# Altium project Sayma_AMC.PrjPcb (part 13 of 18)

## Sheet FPGA_Banks_47_48_HP_FMC.SchDoc: Sayma AMC
size 420 x 297 mm; $$Internal___BlkDate: 0:12:25_2-9-18; $$Internal_NAME_PLACEHOLDER: a3sheet; $$Internal_Resolution: 00001mm; $$NotCommonProperty_@NAME: FPGA_XCKU040FFVA1156; $$NotCommonProperty_@PRINTORDER: 17; $$NotCommonProperty_@SHEET: FPGA Banks 47 48 HP FMC; $$NotCommonProperty_@SHEETTOTAL: 30; CmpIndex: 989; Drawing Author: G.Kasprowicz; Drawing Number: Sayma AMC; Drawing Project: AMC FMC Carrier Board; Drawing Revision: 2.0; SymIndex: 2141; CheckedBy: P.Kulik,T.Przywozki,W.Ruclo; Author: G.Kasprowicz; CompanyName: WUT ISE; DrawnBy: G.Kasprowicz; Organization: WUT ISE; Address1: PW ISE; Address2: Nowowiejska 15/19 00-665 Warsaw; Address3: gkasprow@gmail.com; DocumentNumber: 25; Revision: 2; SheetNumber: 25; SheetTotal: 32; ModifiedBy: -; CheckedDate: -; Title2: FPGA banks 47 & 48 - FMC; DivGrp: WUT ISE; Designer: G.Kasprowicz; ModifiedDate: -; ProjectName: Sensor Box
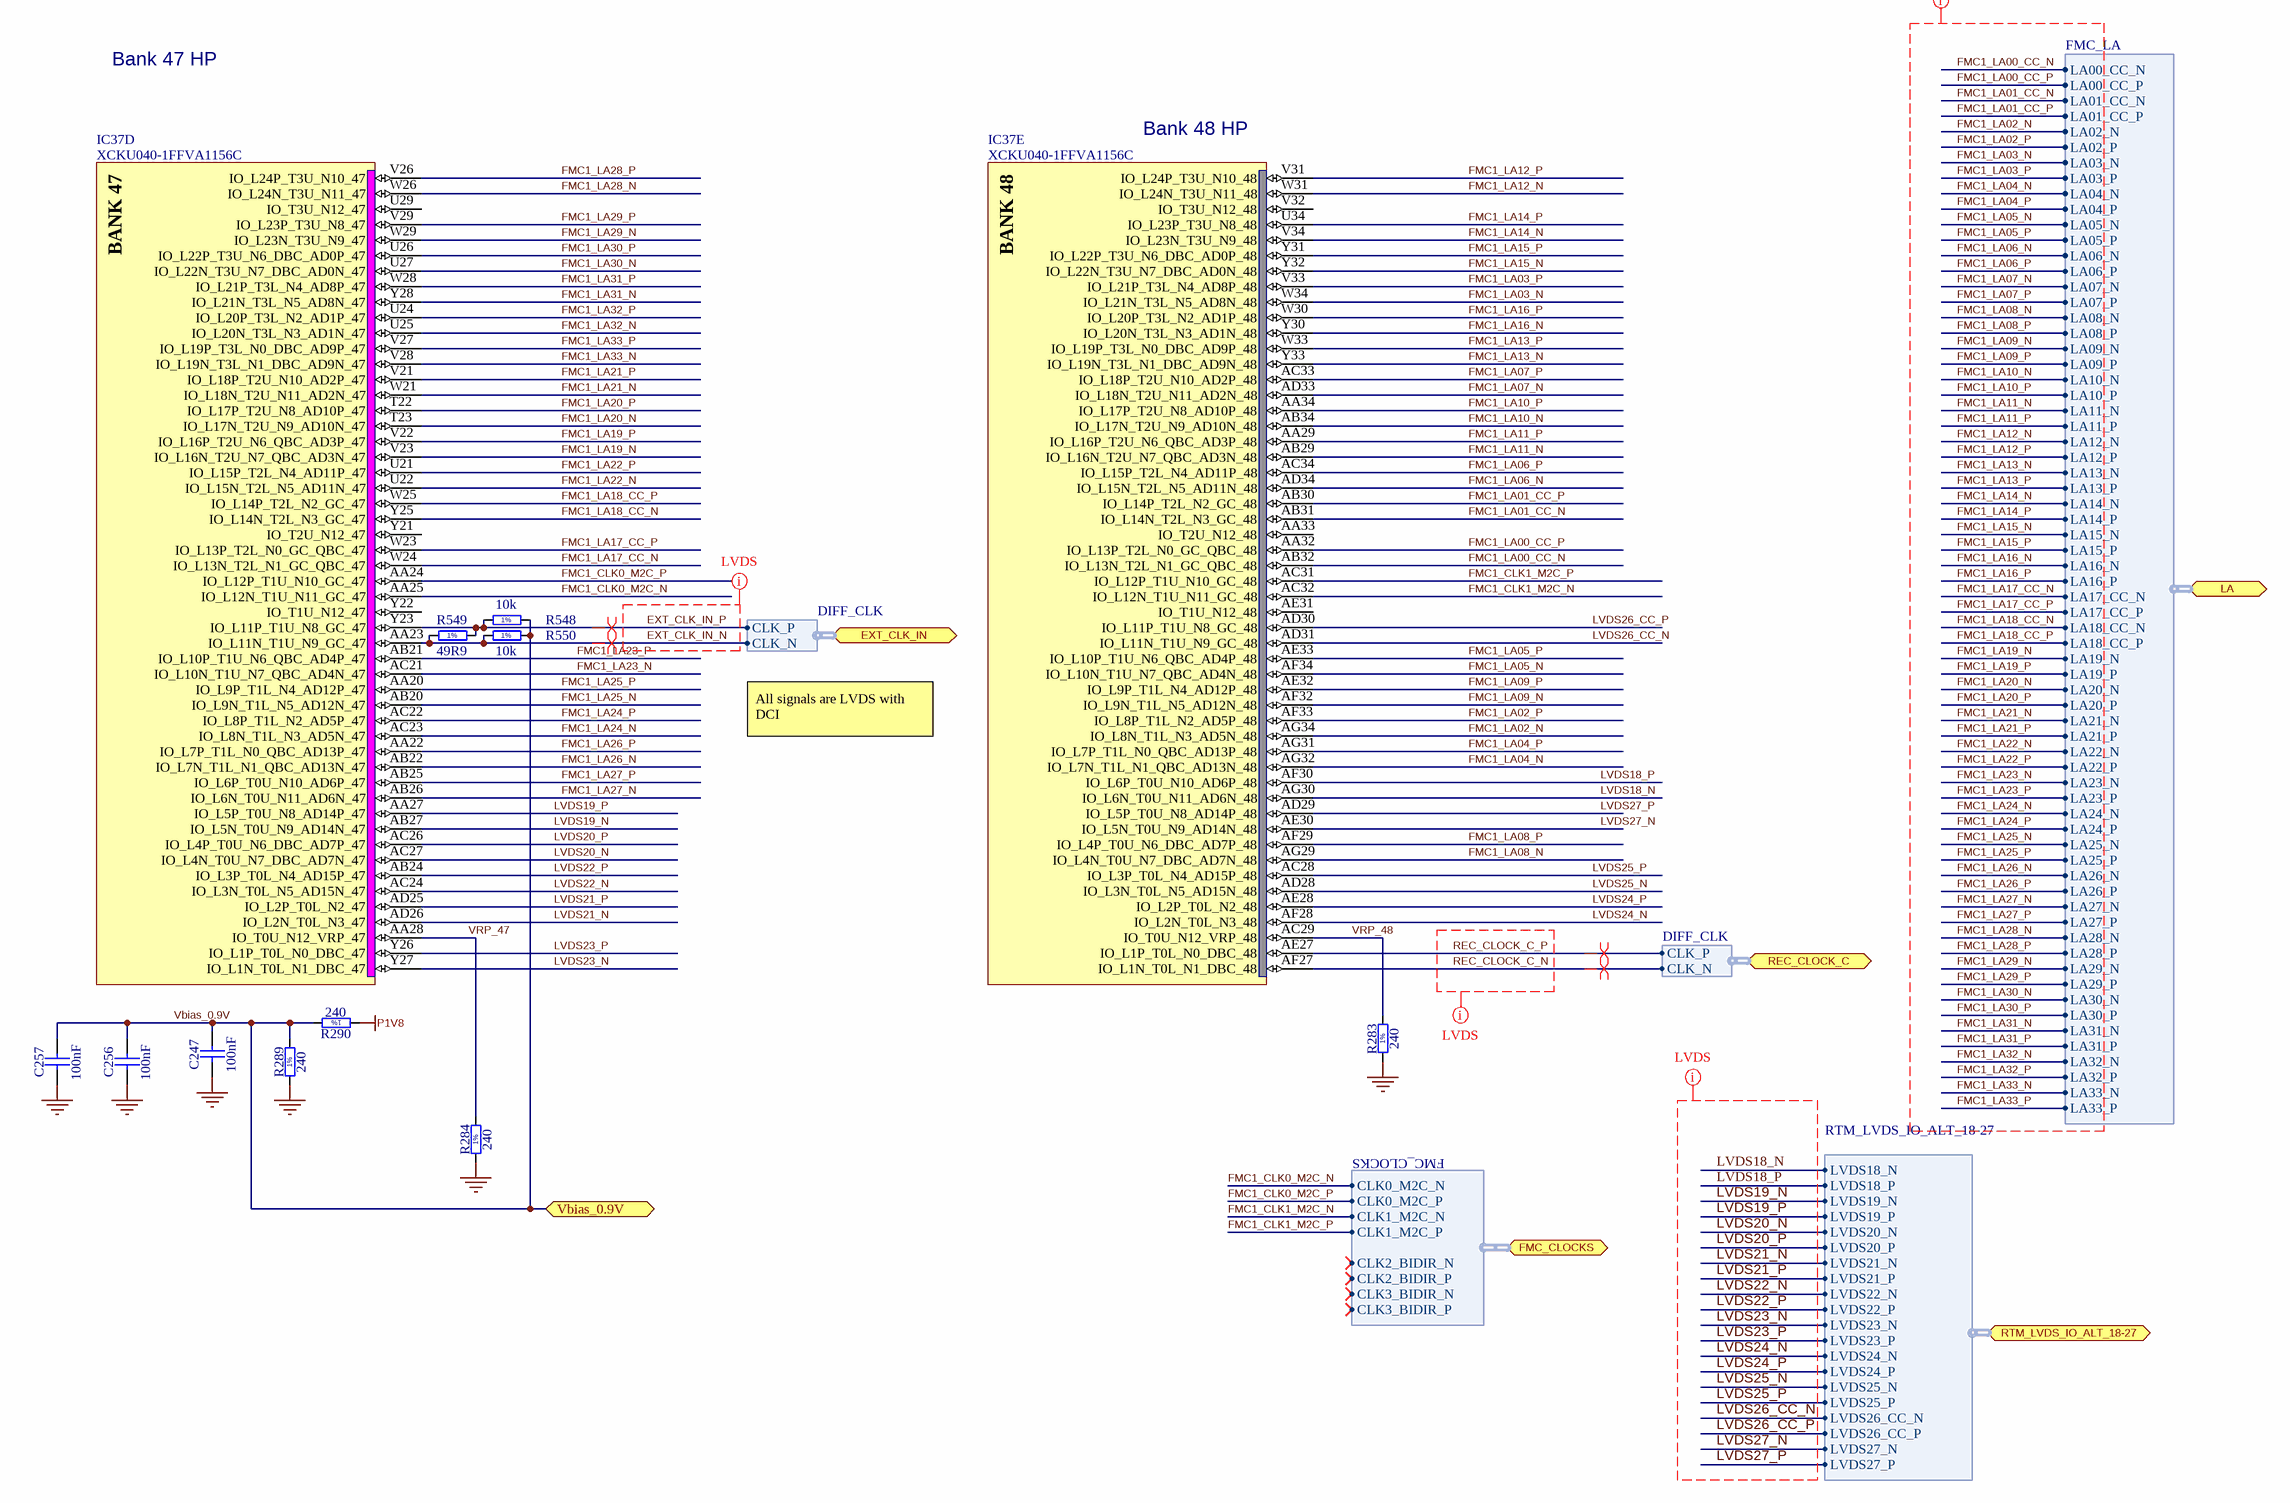
[diagram p22: FPGA_Banks_47_48_HP_FMC.SchDoc]

### Parts
C247  100nF  [CAPC0603X33N]
C256  100nF  [CAPC0603X33N]
C257  100nF  [CAPC0603X33N]
IC37  XCKU040-1FFVA1156C  [BGA1156C100P34X34_3500X3500X350]  (parts D,E of 22)
R283  240  [RESC1005X40N]
R284  240  [RESC1005X40N]
R289  240  [RESC1005X40N]
R290  240  [RESC1005X40N]
R548  10k  [RESC1005X40N]
R549  49R9  [RESC1005X40N]
R550  10k  [RESC1005X40N]

### Ports
EXT_CLK_IN (bidir, harness DIFF_CLK), FMC_CLOCKS (bidir, harness FMC_CLOCKS), LA (bidir, harness FMC_LA), REC_CLOCK_C (bidir, harness DIFF_CLK), RTM_LVDS_IO_ALT_18-27 (bidir, harness RTM_LVDS_IO_ALT_18-27), Vbias_0.9V (bidir)

### Harnesses
RTM_LVDS_IO_ALT_18-27: LVDS19_N, LVDS19_P, LVDS20_N, LVDS20_P, LVDS21_N, LVDS21_P, LVDS22_N, LVDS22_P, LVDS23_N, LVDS23_P, LVDS24_N, LVDS24_P, LVDS25_N, LVDS25_P, LVDS26_CC_N, LVDS26_CC_P, LVDS27_N, LVDS27_P, LVDS18_N, LVDS18_P
FMC_LA: LA00_CC_N, LA00_CC_P, LA01_CC_N, LA01_CC_P, LA02_N, LA02_P, LA03_N, LA03_P, LA04_N, LA04_P, LA05_N, LA05_P, LA06_N, LA06_P, LA07_N, LA07_P, LA08_N, LA08_P, LA09_N, LA09_P, LA10_N, LA10_P, LA11_N, LA11_P, LA12_N, LA12_P, LA13_N, LA13_P, LA14_N, LA14_P, LA15_N, LA15_P, LA16_N, LA16_P, LA17_CC_N, LA17_CC_P, LA18_CC_N, LA18_CC_P, LA19_N, LA19_P, LA20_N, LA20_P, LA21_N, LA21_P, LA22_N, LA22_P, LA23_N, LA23_P, LA24_N, LA25_N, LA25_P, LA24_P, LA26_N, LA26_P, LA27_N, LA27_P, LA28_N, LA28_P, LA29_N, LA29_P, LA30_N, LA30_P, LA31_N, LA31_P, LA32_N, LA32_P, LA33_N, LA33_P
FMC_CLOCKS: CLK0_M2C_N, CLK0_M2C_P, CLK1_M2C_N, CLK1_M2C_P, CLK2_BIDIR_N, CLK2_BIDIR_P, CLK3_BIDIR_N, CLK3_BIDIR_P
DIFF_CLK: CLK_N, CLK_P

### Nets
GND: C247.2 C256.2 C257.2 R283.1 R284.1 R289.1
P1V8: R290.1
EXT_CLK_IN_N: IC37.AA23(IO_L11N_T1U_N9_GC_47) R549.1 R550.1 ; port EXT_CLK_IN.CLK_N
EXT_CLK_IN_P: IC37.Y23(IO_L11P_T1U_N8_GC_47) R548.1 R549.2 ; port EXT_CLK_IN.CLK_P
FMC1_CLK0_M2C_N: IC37.AA25(IO_L12N_T1U_N11_GC_47) ; port FMC_CLOCKS.CLK0_M2C_N  [project net CLK0_M2C_N]
FMC1_CLK0_M2C_P: IC37.AA24(IO_L12P_T1U_N10_GC_47) ; port FMC_CLOCKS.CLK0_M2C_P  [project net CLK0_M2C_P]
FMC1_CLK1_M2C_N: IC37.AC32(IO_L12N_T1U_N11_GC_48) ; port FMC_CLOCKS.CLK1_M2C_N  [project net CLK1_M2C_N]
FMC1_CLK1_M2C_P: IC37.AC31(IO_L12P_T1U_N10_GC_48) ; port FMC_CLOCKS.CLK1_M2C_P  [project net CLK1_M2C_P]
FMC1_LA00_CC_N: IC37.AB32(IO_L13N_T2L_N1_GC_QBC_48) ; port LA.LA00_CC_N
FMC1_LA00_CC_P: IC37.AA32(IO_L13P_T2L_N0_GC_QBC_48) ; port LA.LA00_CC_P
FMC1_LA01_CC_N: IC37.AB31(IO_L14N_T2L_N3_GC_48) ; port LA.LA01_CC_N
FMC1_LA01_CC_P: IC37.AB30(IO_L14P_T2L_N2_GC_48) ; port LA.LA01_CC_P
FMC1_LA02_N: IC37.AG34(IO_L8N_T1L_N3_AD5N_48) ; port LA.LA02_N
FMC1_LA02_P: IC37.AF33(IO_L8P_T1L_N2_AD5P_48) ; port LA.LA02_P
FMC1_LA03_N: IC37.W34(IO_L21N_T3L_N5_AD8N_48) ; port LA.LA03_N
FMC1_LA03_P: IC37.V33(IO_L21P_T3L_N4_AD8P_48) ; port LA.LA03_P
FMC1_LA04_N: IC37.AG32(IO_L7N_T1L_N1_QBC_AD13N_48) ; port LA.LA04_N
FMC1_LA04_P: IC37.AG31(IO_L7P_T1L_N0_QBC_AD13P_48) ; port LA.LA04_P
FMC1_LA05_N: IC37.AF34(IO_L10N_T1U_N7_QBC_AD4N_48) ; port LA.LA05_N
FMC1_LA05_P: IC37.AE33(IO_L10P_T1U_N6_QBC_AD4P_48) ; port LA.LA05_P
FMC1_LA06_N: IC37.AD34(IO_L15N_T2L_N5_AD11N_48) ; port LA.LA06_N
FMC1_LA06_P: IC37.AC34(IO_L15P_T2L_N4_AD11P_48) ; port LA.LA06_P
FMC1_LA07_N: IC37.AD33(IO_L18N_T2U_N11_AD2N_48) ; port LA.LA07_N
FMC1_LA07_P: IC37.AC33(IO_L18P_T2U_N10_AD2P_48) ; port LA.LA07_P
FMC1_LA08_N: IC37.AG29(IO_L4N_T0U_N7_DBC_AD7N_48) ; port LA.LA08_N
FMC1_LA08_P: IC37.AF29(IO_L4P_T0U_N6_DBC_AD7P_48) ; port LA.LA08_P
FMC1_LA09_N: IC37.AF32(IO_L9N_T1L_N5_AD12N_48) ; port LA.LA09_N
FMC1_LA09_P: IC37.AE32(IO_L9P_T1L_N4_AD12P_48) ; port LA.LA09_P
FMC1_LA10_N: IC37.AB34(IO_L17N_T2U_N9_AD10N_48) ; port LA.LA10_N
FMC1_LA10_P: IC37.AA34(IO_L17P_T2U_N8_AD10P_48) ; port LA.LA10_P
FMC1_LA11_N: IC37.AB29(IO_L16N_T2U_N7_QBC_AD3N_48) ; port LA.LA11_N
FMC1_LA11_P: IC37.AA29(IO_L16P_T2U_N6_QBC_AD3P_48) ; port LA.LA11_P
FMC1_LA12_N: IC37.W31(IO_L24N_T3U_N11_48) ; port LA.LA12_N
FMC1_LA12_P: IC37.V31(IO_L24P_T3U_N10_48) ; port LA.LA12_P
FMC1_LA13_N: IC37.Y33(IO_L19N_T3L_N1_DBC_AD9N_48) ; port LA.LA13_N
FMC1_LA13_P: IC37.W33(IO_L19P_T3L_N0_DBC_AD9P_48) ; port LA.LA13_P
FMC1_LA14_N: IC37.V34(IO_L23N_T3U_N9_48) ; port LA.LA14_N
FMC1_LA14_P: IC37.U34(IO_L23P_T3U_N8_48) ; port LA.LA14_P
FMC1_LA15_N: IC37.Y32(IO_L22N_T3U_N7_DBC_AD0N_48) ; port LA.LA15_N
FMC1_LA15_P: IC37.Y31(IO_L22P_T3U_N6_DBC_AD0P_48) ; port LA.LA15_P
FMC1_LA16_N: IC37.Y30(IO_L20N_T3L_N3_AD1N_48) ; port LA.LA16_N
FMC1_LA16_P: IC37.W30(IO_L20P_T3L_N2_AD1P_48) ; port LA.LA16_P
FMC1_LA17_CC_N: IC37.W24(IO_L13N_T2L_N1_GC_QBC_47) ; port LA.LA17_CC_N
FMC1_LA17_CC_P: IC37.W23(IO_L13P_T2L_N0_GC_QBC_47) ; port LA.LA17_CC_P
FMC1_LA18_CC_N: IC37.Y25(IO_L14N_T2L_N3_GC_47) ; port LA.LA18_CC_N
FMC1_LA18_CC_P: IC37.W25(IO_L14P_T2L_N2_GC_47) ; port LA.LA18_CC_P
FMC1_LA19_N: IC37.V23(IO_L16N_T2U_N7_QBC_AD3N_47) ; port LA.LA19_N
FMC1_LA19_P: IC37.V22(IO_L16P_T2U_N6_QBC_AD3P_47) ; port LA.LA19_P
FMC1_LA20_N: IC37.T23(IO_L17N_T2U_N9_AD10N_47) ; port LA.LA20_N
FMC1_LA20_P: IC37.T22(IO_L17P_T2U_N8_AD10P_47) ; port LA.LA20_P
FMC1_LA21_N: IC37.W21(IO_L18N_T2U_N11_AD2N_47) ; port LA.LA21_N
FMC1_LA21_P: IC37.V21(IO_L18P_T2U_N10_AD2P_47) ; port LA.LA21_P
FMC1_LA22_N: IC37.U22(IO_L15N_T2L_N5_AD11N_47) ; port LA.LA22_N
FMC1_LA22_P: IC37.U21(IO_L15P_T2L_N4_AD11P_47) ; port LA.LA22_P
FMC1_LA23_N: IC37.AC21(IO_L10N_T1U_N7_QBC_AD4N_47) ; port LA.LA23_N
FMC1_LA23_P: IC37.AB21(IO_L10P_T1U_N6_QBC_AD4P_47) ; port LA.LA23_P
FMC1_LA24_N: IC37.AC23(IO_L8N_T1L_N3_AD5N_47) ; port LA.LA24_N
FMC1_LA24_P: IC37.AC22(IO_L8P_T1L_N2_AD5P_47) ; port LA.LA24_P
FMC1_LA25_N: IC37.AB20(IO_L9N_T1L_N5_AD12N_47) ; port LA.LA25_N
FMC1_LA25_P: IC37.AA20(IO_L9P_T1L_N4_AD12P_47) ; port LA.LA25_P
FMC1_LA26_N: IC37.AB22(IO_L7N_T1L_N1_QBC_AD13N_47) ; port LA.LA26_N
FMC1_LA26_P: IC37.AA22(IO_L7P_T1L_N0_QBC_AD13P_47) ; port LA.LA26_P
FMC1_LA27_N: IC37.AB26(IO_L6N_T0U_N11_AD6N_47) ; port LA.LA27_N
FMC1_LA27_P: IC37.AB25(IO_L6P_T0U_N10_AD6P_47) ; port LA.LA27_P
FMC1_LA28_N: IC37.W26(IO_L24N_T3U_N11_47) ; port LA.LA28_N
FMC1_LA28_P: IC37.V26(IO_L24P_T3U_N10_47) ; port LA.LA28_P
FMC1_LA29_N: IC37.W29(IO_L23N_T3U_N9_47) ; port LA.LA29_N
FMC1_LA29_P: IC37.V29(IO_L23P_T3U_N8_47) ; port LA.LA29_P
FMC1_LA30_N: IC37.U27(IO_L22N_T3U_N7_DBC_AD0N_47) ; port LA.LA30_N
FMC1_LA30_P: IC37.U26(IO_L22P_T3U_N6_DBC_AD0P_47) ; port LA.LA30_P
FMC1_LA31_N: IC37.Y28(IO_L21N_T3L_N5_AD8N_47) ; port LA.LA31_N
FMC1_LA31_P: IC37.W28(IO_L21P_T3L_N4_AD8P_47) ; port LA.LA31_P
FMC1_LA32_N: IC37.U25(IO_L20N_T3L_N3_AD1N_47) ; port LA.LA32_N
FMC1_LA32_P: IC37.U24(IO_L20P_T3L_N2_AD1P_47) ; port LA.LA32_P
FMC1_LA33_N: IC37.V28(IO_L19N_T3L_N1_DBC_AD9N_47) ; port LA.LA33_N
FMC1_LA33_P: IC37.V27(IO_L19P_T3L_N0_DBC_AD9P_47) ; port LA.LA33_P
LVDS18_N: IC37.AG30(IO_L6N_T0U_N11_AD6N_48) ; port RTM_LVDS_IO_ALT_18-27.LVDS18_N
LVDS18_P: IC37.AF30(IO_L6P_T0U_N10_AD6P_48) ; port RTM_LVDS_IO_ALT_18-27.LVDS18_P
LVDS19_N: IC37.AB27(IO_L5N_T0U_N9_AD14N_47) ; port RTM_LVDS_IO_ALT_18-27.LVDS19_N
LVDS19_P: IC37.AA27(IO_L5P_T0U_N8_AD14P_47) ; port RTM_LVDS_IO_ALT_18-27.LVDS19_P
LVDS20_N: IC37.AC27(IO_L4N_T0U_N7_DBC_AD7N_47) ; port RTM_LVDS_IO_ALT_18-27.LVDS20_N
LVDS20_P: IC37.AC26(IO_L4P_T0U_N6_DBC_AD7P_47) ; port RTM_LVDS_IO_ALT_18-27.LVDS20_P
LVDS21_N: IC37.AD26(IO_L2N_T0L_N3_47) ; port RTM_LVDS_IO_ALT_18-27.LVDS21_N
LVDS21_P: IC37.AD25(IO_L2P_T0L_N2_47) ; port RTM_LVDS_IO_ALT_18-27.LVDS21_P
LVDS22_N: IC37.AC24(IO_L3N_T0L_N5_AD15N_47) ; port RTM_LVDS_IO_ALT_18-27.LVDS22_N
LVDS22_P: IC37.AB24(IO_L3P_T0L_N4_AD15P_47) ; port RTM_LVDS_IO_ALT_18-27.LVDS22_P
LVDS23_N: IC37.Y27(IO_L1N_T0L_N1_DBC_47) ; port RTM_LVDS_IO_ALT_18-27.LVDS23_N
LVDS23_P: IC37.Y26(IO_L1P_T0L_N0_DBC_47) ; port RTM_LVDS_IO_ALT_18-27.LVDS23_P
LVDS24_N: IC37.AF28(IO_L2N_T0L_N3_48) ; port RTM_LVDS_IO_ALT_18-27.LVDS24_N
LVDS24_P: IC37.AE28(IO_L2P_T0L_N2_48) ; port RTM_LVDS_IO_ALT_18-27.LVDS24_P
LVDS25_N: IC37.AD28(IO_L3N_T0L_N5_AD15N_48) ; port RTM_LVDS_IO_ALT_18-27.LVDS25_N
LVDS25_P: IC37.AC28(IO_L3P_T0L_N4_AD15P_48) ; port RTM_LVDS_IO_ALT_18-27.LVDS25_P
LVDS26_CC_N: IC37.AD31(IO_L11N_T1U_N9_GC_48) ; port RTM_LVDS_IO_ALT_18-27.LVDS26_CC_N
LVDS26_CC_P: IC37.AD30(IO_L11P_T1U_N8_GC_48) ; port RTM_LVDS_IO_ALT_18-27.LVDS26_CC_P
LVDS27_N: IC37.AE30(IO_L5N_T0U_N9_AD14N_48) ; port RTM_LVDS_IO_ALT_18-27.LVDS27_N
LVDS27_P: IC37.AD29(IO_L5P_T0U_N8_AD14P_48) ; port RTM_LVDS_IO_ALT_18-27.LVDS27_P
REC_CLOCK_C_N: IC37.AF27(IO_L1N_T0L_N1_DBC_48) ; port REC_CLOCK_C.CLK_N
REC_CLOCK_C_P: IC37.AE27(IO_L1P_T0L_N0_DBC_48) ; port REC_CLOCK_C.CLK_P
Vbias_0.9V: C247.1 C256.1 C257.1 R289.2 R290.2 R548.2 R550.2 ; port Vbias_0.9V
VRP_47: IC37.AA28(IO_T0U_N12_VRP_47) R284.2
VRP_48: IC37.AC29(IO_T0U_N12_VRP_48) R283.2

Not connected (* = marked no-connect by the designer): IC37 AA33(IO_T2U_N12_48) AE31(IO_T1U_N12_48) U29(IO_T3U_N12_47) V32(IO_T3U_N12_48) Y21(IO_T2U_N12_47) Y22(IO_T1U_N12_47)

### Layout directives
differential pair: EXT_CLK_IN_N, EXT_CLK_IN_P, REC_CLOCK_C_N, REC_CLOCK_C_P
net class LVDS: EXT_CLK_IN_N, EXT_CLK_IN_P, LVDS18_N, LVDS18_P, LVDS19_N, LVDS19_P, LVDS20_N, LVDS20_P, LVDS21_N, LVDS21_P, LVDS22_N, LVDS22_P, LVDS23_N, LVDS23_P, LVDS24_N, LVDS24_P, LVDS25_N, LVDS25_P, LVDS26_CC_N, LVDS26_CC_P, LVDS27_N, LVDS27_P, REC_CLOCK_C_N, REC_CLOCK_C_P
net class LVDS_FMC: FMC1_LA00_CC_N, FMC1_LA00_CC_P, FMC1_LA01_CC_N, FMC1_LA01_CC_P, FMC1_LA02_N, FMC1_LA02_P, FMC1_LA03_N, FMC1_LA03_P, FMC1_LA04_N, FMC1_LA04_P, FMC1_LA05_N, FMC1_LA05_P, FMC1_LA06_N, FMC1_LA06_P, FMC1_LA07_N, FMC1_LA07_P, FMC1_LA08_N, FMC1_LA08_P, FMC1_LA09_N, FMC1_LA09_P, FMC1_LA10_N, FMC1_LA10_P, FMC1_LA11_N, FMC1_LA11_P, FMC1_LA12_N, FMC1_LA12_P, FMC1_LA13_N, FMC1_LA13_P, FMC1_LA14_N, FMC1_LA14_P, FMC1_LA15_N, FMC1_LA15_P, FMC1_LA16_N, FMC1_LA16_P, FMC1_LA17_CC_N, FMC1_LA17_CC_P, FMC1_LA18_CC_N, FMC1_LA18_CC_P, FMC1_LA19_N, FMC1_LA19_P, FMC1_LA20_N, FMC1_LA20_P, FMC1_LA21_N, FMC1_LA21_P, FMC1_LA22_N, FMC1_LA22_P, FMC1_LA23_N, FMC1_LA23_P, FMC1_LA24_N, FMC1_LA24_P, FMC1_LA25_N, FMC1_LA25_P, FMC1_LA26_N, FMC1_LA26_P, FMC1_LA27_N, FMC1_LA27_P, FMC1_LA28_N, FMC1_LA28_P, FMC1_LA29_N, FMC1_LA29_P, FMC1_LA30_N, FMC1_LA30_P, FMC1_LA31_N, FMC1_LA31_P, FMC1_LA32_N, FMC1_LA32_P, FMC1_LA33_N, FMC1_LA33_P

### Notes on the sheet
- Bank 47 HP
- (near IC37) Bank 48 HP
- All signals are LVDS with DCI
- Project/Equipment
- Document
- Designer
- Drawn by
- Check.by
- Copyright WUT ISE 2018.
  This documentation describes Open Hardware and is licensed under the CERN OHL v.1.1. You may redistribute and modify this documentation under the terms of the CERN OHL v.1.1. (http://ohwr.org/CERNOHL). This documentation is distributed WITHOUT ANY EXPRESS OR IMPLIED WARRANTY, INCLUDING OF MERCHANTABILITY, SATISFACTORY QUALITY AND FITNESS FOR A PARTICULAR PURPOSE. Please see the CERN OHL v.1.1 for applicable conditions.
- Contact
- File
- Last Mod.
- Print Date
- Sheet
- Size
- A3
- of
- Rev
- (in symbol R0402_10K_1%_0.0625W_100PPM) 1%
- (in symbol R0402_49R9_1%_0.0625W_100PPM) 1%
- (in symbol R0402_240R_1%_0.0625W_100PPM) 1%
- (in symbol XCKU040-1FFVA1156C, part D) BANK 47
- (in symbol XCKU040-1FFVA1156C, part E) BANK 48

### Library data of the parts
C247 C256 C257 = CC0201_100NF_6.3V_10%_X5R: Non-polarised capacitor; Manufacturer: GENERIC; Part Description: SMD Multilayer Chip Ceramic Capacitor; Manufacturer1 Part Number: 02016D104KAT2A; Tolerance: ±10%; Voltage: 6.3V; TC: X5R; Manufacturer Part Number: CC0201_100NF_6.3V_10%_X5R; Part Number: CC0201_100NF_6.3V_10%_X5R; Value: 100nF; Component Kind: Standard; Component Type: Standard; Pin Count: 2; Status: Not Recommended; Case: 0201; Mounted: Yes; Socket: No; SMD: Yes; Sense: No; Manufacturer1 Example: AVX; Manufacturer1 ComponentHeight: 0.33mm; HelpURL: \\cern.ch\dfs\Applications\Altium\Datasheets\CC0201_X5R_AVX.pdf; Author: CERN DEM JLC; CreateDate: 03.12.2007; LatestRevisionDate: 03.12.2007
IC37 = XCKU040-1FFVA1156C: Kintex UltraScale FPGA, 520 I/O, 530K Cells, 1156-Ball BGA, Speed Grade 1, Commercial Grade; Manufacturer: XILINX; Part Description: Kintex UltraScale, 40 DLL I/O, 416 HP I/O, 104 HR I/O, 1156-Pin BGA, Speed Grade 1, Commercial Grade; PressFit: No; Bonding: No; Manufacturer Part Number: XCKU040-1FFVA1156C; PackageDescription: BGA, 1.00mm Pitch, Square; 1156 Pin, 34 Columns X 34 Rows, Body 35.00mm X 35.00mm X 3.50mm H, IPC Medium Density; Part Number: XCKU040-1FFVA1156C; Component Kind: Standard; Component Type: Standard; Device: XCKU040-1FFVA1156C; Pin Count: 1156; Case: BGA1156; Mounted: Yes; Socket: No; SMD: Yes; Sense: No; ComponentHeight: 3.5mm; HelpURL: \\cern.ch\dfs\Applications\Altium\Datasheets\XCKU040-1FFVA1156C.pdf; ComponentLink1URL: \\cern.ch\dfs\Applications\Altium\Datasheets\XCKU040-1FFVA1156C_Package-Pinout.pdf; ComponentLink1Description: Package/Pinout; Author: CERN DEM CA; CreateDate: 16.08.2016; LatestRevisionDate: 16.08.2016
R283 R284 R289 R290 = R0402_240R_1%_0.0625W_100PPM: Resistor - 1%; Manufacturer: GENERIC; Part Description: General Purpose Thick Film Chip Resistor; Manufacturer1 Part Number: 232270672401L; TC: ±100ppm/°C; PressFit: No; Manufacturer Part Number: R0402_240R_1%_0.0625W_100PPM; Part Number: R0402_240R_1%_0.0625W_100PPM; Tolerance: ±1%; Value: 240; Component Kind: Standard; Component Type: Standard; Pin Count: 2; Status: Not Recommended; Power: 0.0625W; Case: 0402; Mounted: Yes; Sense: No; Socket: No; SMD: Yes; Manufacturer1 Example: YAGEO PHYCOMP; Manufacturer1 ComponentHeight: 0.4mm; HelpURL: \\cern.ch\dfs\Applications\Altium\Datasheets\R0402_Phycomp_RC0402.pdf; Author: CERN DEM JLC; CreateDate: 03.12.2007; LatestRevisionDate: 17.10.2012
R548 R550 = R0402_10K_1%_0.0625W_100PPM: Resistor - 1%; Manufacturer: GENERIC; Part Description: General Purpose Thick Film Chip Resistor; Manufacturer1 Part Number: 232270671003L; TC: ±100ppm/°C; PressFit: No; Manufacturer Part Number: R0402_10K_1%_0.0625W_100PPM; Part Number: R0402_10K_1%_0.0625W_100PPM; Tolerance: ±1%; Value: 10k; Component Kind: Standard; Component Type: Standard; Pin Count: 2; Status: Not Recommended; Power: 0.0625W; Case: 0402; Mounted: Yes; Sense: No; Socket: No; SMD: Yes; Manufacturer1 Example: YAGEO PHYCOMP; Manufacturer1 ComponentHeight: 0.4mm; HelpURL: \\cern.ch\dfs\Applications\Altium\Datasheets\R0402_Phycomp_RC0402.pdf; Author: CERN DEM JLC; CreateDate: 03.12.2007; LatestRevisionDate: 17.10.2012
R549 = R0402_49R9_1%_0.0625W_100PPM: Resistor - 1%; Manufacturer: GENERIC; Part Description: General Purpose Thick Film Chip Resistor; Manufacturer1 Part Number: 232270674999L or RC0402FR-0749R9L; TC: ±100ppm/°C; PressFit: No; Manufacturer Part Number: R0402_49R9_1%_0.0625W_100PPM; Part Number: R0402_49R9_1%_0.0625W_100PPM; Tolerance: ±1%; Value: 49R9; Component Kind: Standard; Component Type: Standard; Pin Count: 2; Status: Not Recommended; Power: 0.0625W; Case: 0402; Mounted: Yes; Sense: No; Socket: No; SMD: Yes; Manufacturer1 Example: YAGEO PHYCOMP; Manufacturer1 ComponentHeight: 0.4mm; HelpURL: \\cern.ch\dfs\Applications\Altium\Datasheets\R0402_Phycomp_RC0402.pdf; Author: CERN DEM JLC; CreateDate: 24.10.2012; LatestRevisionDate: 24.10.2012

## Sheet FPGA_Banks_64_65_HR.SchDoc: Sayma AMC
size 420 x 297 mm; $$Internal___BlkDate: 0:12:25_2-9-18; $$Internal_NAME_PLACEHOLDER: a3sheet; $$Internal_Resolution: 00001mm; $$NotCommonProperty_@NAME: FPGA_XCKU040FFVA1156; $$NotCommonProperty_@PRINTORDER: 18; $$NotCommonProperty_@SHEET: FPGA Banks 64 65 HR; $$NotCommonProperty_@SHEETTOTAL: 30; CmpIndex: 990; Drawing Author: G.Kasprowicz; Drawing Number: Sayma AMC; Drawing Project: AMC FMC Carrier Board; Drawing Revision: 2.0; SymIndex: 2141; CheckedBy: P.Kulik,T.Przywozki,W.Ruclo; Author: G.Kasprowicz; CompanyName: WUT ISE; DrawnBy: G.Kasprowicz; Organization: WUT ISE; Address1: PW ISE; Address2: Nowowiejska 15/19 00-665 Warsaw; Address3: gkasprow@gmail.com; DocumentNumber: 26; Revision: 2; SheetNumber: 26; SheetTotal: 32; ModifiedBy: -; CheckedDate: -; Title2: FPGA banks 64 & 65; DivGrp: WUT ISE; Designer: G.Kasprowicz; ModifiedDate: -; ProjectName: Sensor Box
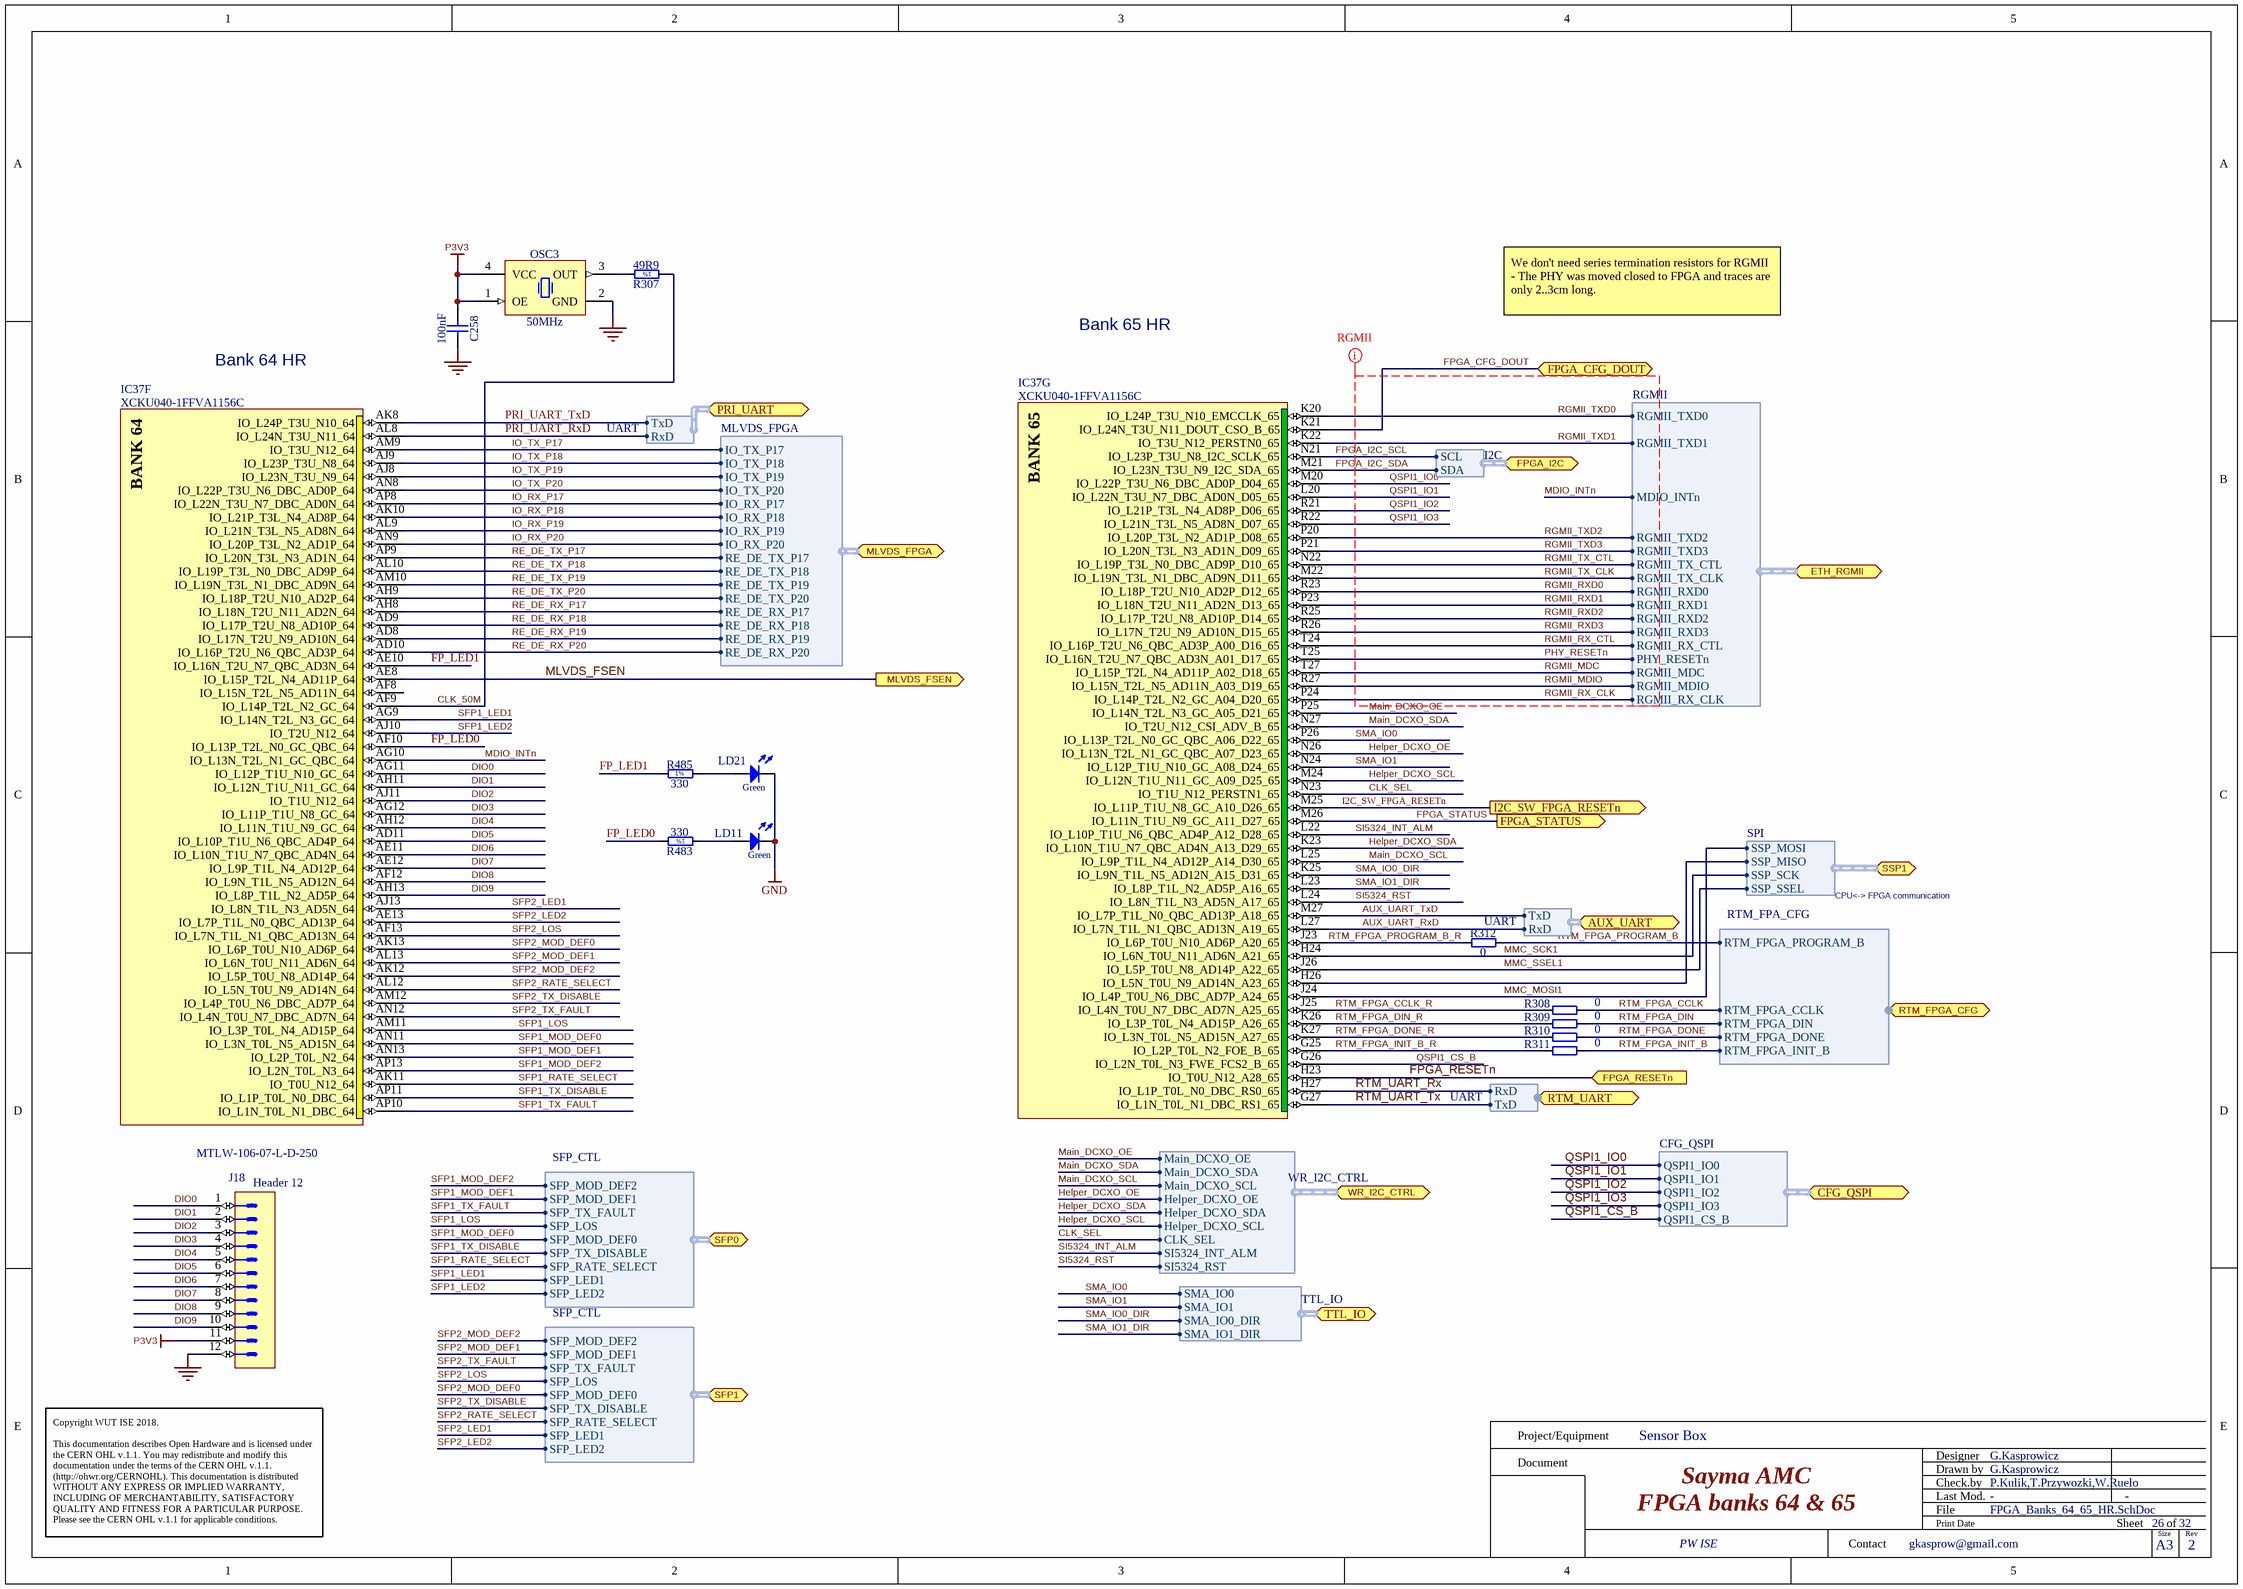
[diagram p23: FPGA_Banks_64_65_HR.SchDoc]

### Parts
C258  100nF  [CAPC0603X33N]
IC37  XCKU040-1FFVA1156C  [BGA1156C100P34X34_3500X3500X350]  (parts F,G of 22)
J18  Header 12  Manufacturer Part Number: MTLW-106-07-L-D-250  [SAMTEC_MTLW-106-07-L-D-250]
LD11  Green  [LED_AVAGO_HSME-C120]
LD21  Green  [LED_KINGBRIGHT_KPH-1608CGCK]
OSC3  50MHz  [OSCSC254P320X500X130-4N]
R307  49R9  [RESC1005X40N]
R308  0  [RESC1005X40N]
R309  0  [RESC1005X40N]
R310  0  [RESC1005X40N]
R311  0  [RESC1005X40N]
R312  0  [RESC1005X40N]
R483  330  [RESC1005X40N]
R485  330  [RESC1005X40N]

### Ports
AUX_UART (bidir, harness UART), CFG_QSPI (bidir, harness CFG_QSPI), ETH_RGMII (bidir, harness RGMII), FPGA_CFG_DOUT (bidir), FPGA_I2C (bidir, harness I2C), FPGA_RESETn (in), FPGA_STATUS (out), I2C_SW_FPGA_RESETn (out), MLVDS_FPGA (bidir, harness MLVDS_FPGA), MLVDS_FSEN (out), PRI_UART (bidir, harness UART), RTM_FPGA_CFG (bidir, harness RTM_FPA_CFG), RTM_UART (bidir, harness UART), SFP0 (bidir, harness SFP_CTL), SFP1 (bidir, harness SFP_CTL), SSP1 (bidir, harness SPI), TTL_IO (bidir, harness TTL_IO), WR_I2C_CTRL (bidir, harness WR_I2C_CTRL)

### Harnesses
SFP_CTL: SFP_MOD_DEF2, SFP_MOD_DEF1, SFP_TX_FAULT, SFP_LOS, SFP_MOD_DEF0, SFP_TX_DISABLE, SFP_RATE_SELECT, SFP_LED1, SFP_LED2
MLVDS_FPGA: IO_TX_P17, IO_RX_P17, IO_RX_P18, IO_RX_P19, IO_RX_P20, IO_TX_P18, IO_TX_P19, IO_TX_P20, RE_DE_TX_P17, RE_DE_TX_P18, RE_DE_TX_P19, RE_DE_TX_P20, RE_DE_RX_P17, RE_DE_RX_P18, RE_DE_RX_P19, RE_DE_RX_P20
I2C: SCL, SDA
SPI: SSP_SCK, SSP_SSEL, SSP_MISO, SSP_MOSI
CFG_QSPI: QSPI1_IO0, QSPI1_IO1, QSPI1_IO2, QSPI1_IO3, QSPI1_CS_B
RTM_FPA_CFG: RTM_FPGA_DIN, RTM_FPGA_CCLK, RTM_FPGA_PROGRAM_B, RTM_FPGA_DONE, RTM_FPGA_INIT_B
UART: RxD, TxD
RGMII: RGMII_RX_CTL, RGMII_RX_CLK, RGMII_RXD3, RGMII_TX_CTL, RGMII_TX_CLK, RGMII_TXD0, RGMII_TXD1, RGMII_TXD2, RGMII_TXD3, RGMII_MDC, RGMII_MDIO, PHY_RESETn, MDIO_INTn, RGMII_RXD0, RGMII_RXD1, RGMII_RXD2
WR_I2C_CTRL: Main_DCXO_OE, Main_DCXO_SDA, Main_DCXO_SCL, Helper_DCXO_OE, Helper_DCXO_SDA, Helper_DCXO_SCL, CLK_SEL, SI5324_INT_ALM, SI5324_RST
TTL_IO: SMA_IO0, SMA_IO1, SMA_IO0_DIR, SMA_IO1_DIR

### Nets
GND: C258.1 J18.12 LD11.1(C) LD21.1(C) OSC3.2(GND)
P3V3: C258.2 J18.11 OSC3.1(OE) OSC3.4(VCC)
AUX_UART_RxD: IC37.L27(IO_L7N_T1L_N1_QBC_AD13N_A19_65) ; port AUX_UART.RxD
AUX_UART_TxD: IC37.M27(IO_L7P_T1L_N0_QBC_AD13P_A18_65) ; port AUX_UART.TxD
CLK_50M: IC37.AF9(IO_L14P_T2L_N2_GC_64) R307.1
CLK_SEL: IC37.N23(IO_T1U_N12_PERSTN1_65) ; port WR_I2C_CTRL.CLK_SEL
DIO0: IC37.AG11(IO_L12P_T1U_N10_GC_64) J18.1
DIO1: IC37.AH11(IO_L12N_T1U_N11_GC_64) J18.2
DIO2: IC37.AJ11(IO_T1U_N12_64) J18.3
DIO3: IC37.AG12(IO_L11P_T1U_N8_GC_64) J18.4
DIO4: IC37.AH12(IO_L11N_T1U_N9_GC_64) J18.5
DIO5: IC37.AD11(IO_L10P_T1U_N6_QBC_AD4P_64) J18.6
DIO6: IC37.AE11(IO_L10N_T1U_N7_QBC_AD4N_64) J18.7
DIO7: IC37.AE12(IO_L9P_T1L_N4_AD12P_64) J18.8
DIO8: IC37.AF12(IO_L9N_T1L_N5_AD12N_64) J18.9
DIO9: IC37.AH13(IO_L8P_T1L_N2_AD5P_64) J18.10
FP_LED0: IC37.AF10(IO_L13P_T2L_N0_GC_QBC_64) R483.2
FP_LED1: IC37.AE10(IO_L16N_T2U_N7_QBC_AD3N_64) R485.1
FPGA_CFG_DOUT: IC37.K21(IO_L24N_T3U_N11_DOUT_CSO_B_65) ; port FPGA_CFG_DOUT
FPGA_I2C_SCL: IC37.N21(IO_L23P_T3U_N8_I2C_SCLK_65) ; port FPGA_I2C.SCL
FPGA_I2C_SDA: IC37.M21(IO_L23N_T3U_N9_I2C_SDA_65) ; port FPGA_I2C.SDA
FPGA_RESETn: IC37.H23(IO_T0U_N12_A28_65) ; port FPGA_RESETn
FPGA_STATUS: IC37.M26(IO_L11N_T1U_N9_GC_A11_D27_65) ; port FPGA_STATUS
Helper_DCXO_OE: IC37.N26(IO_L13N_T2L_N1_GC_QBC_A07_D23_65) ; port WR_I2C_CTRL.Helper_DCXO_OE
Helper_DCXO_SCL: IC37.M24(IO_L12N_T1U_N11_GC_A09_D25_65) ; port WR_I2C_CTRL.Helper_DCXO_SCL
Helper_DCXO_SDA: IC37.K23(IO_L10N_T1U_N7_QBC_AD4N_A13_D29_65) ; port WR_I2C_CTRL.Helper_DCXO_SDA
I2C_SW_FPGA_RESETn: IC37.M25(IO_L11P_T1U_N8_GC_A10_D26_65) ; port I2C_SW_FPGA_RESETn
IO_RX_P17: IC37.AP8(IO_L22N_T3U_N7_DBC_AD0N_64) ; port MLVDS_FPGA.IO_RX_P17
IO_RX_P18: IC37.AK10(IO_L21P_T3L_N4_AD8P_64) ; port MLVDS_FPGA.IO_RX_P18
IO_RX_P19: IC37.AL9(IO_L21N_T3L_N5_AD8N_64) ; port MLVDS_FPGA.IO_RX_P19
IO_RX_P20: IC37.AN9(IO_L20P_T3L_N2_AD1P_64) ; port MLVDS_FPGA.IO_RX_P20
IO_TX_P17: IC37.AM9(IO_T3U_N12_64) ; port MLVDS_FPGA.IO_TX_P17
IO_TX_P18: IC37.AJ9(IO_L23P_T3U_N8_64) ; port MLVDS_FPGA.IO_TX_P18
IO_TX_P19: IC37.AJ8(IO_L23N_T3U_N9_64) ; port MLVDS_FPGA.IO_TX_P19
IO_TX_P20: IC37.AN8(IO_L22P_T3U_N6_DBC_AD0P_64) ; port MLVDS_FPGA.IO_TX_P20
Main_DCXO_OE: IC37.P25(IO_L14N_T2L_N3_GC_A05_D21_65) ; port WR_I2C_CTRL.Main_DCXO_OE
Main_DCXO_SCL: IC37.L25(IO_L9P_T1L_N4_AD12P_A14_D30_65) ; port WR_I2C_CTRL.Main_DCXO_SCL
Main_DCXO_SDA: IC37.N27(IO_T2U_N12_CSI_ADV_B_65) ; port WR_I2C_CTRL.Main_DCXO_SDA
MDIO_INTn: IC37.AG10(IO_L13N_T2L_N1_GC_QBC_64) ; port ETH_RGMII.MDIO_INTn
MLVDS_FSEN: IC37.AE8(IO_L15P_T2L_N4_AD11P_64) ; port MLVDS_FSEN
MMC_MISO1: IC37.H26(IO_L5N_T0U_N9_AD14N_A23_65) ; port SSP1.SSP_MISO
MMC_MOSI1: IC37.J24(IO_L4P_T0U_N6_DBC_AD7P_A24_65) ; port SSP1.SSP_MOSI
MMC_SCK1: IC37.H24(IO_L6N_T0U_N11_AD6N_A21_65) ; port SSP1.SSP_SCK
MMC_SSEL1: IC37.J26(IO_L5P_T0U_N8_AD14P_A22_65) ; port SSP1.SSP_SSEL
PHY_RESETn: IC37.T25(IO_L16N_T2U_N7_QBC_AD3N_A01_D17_65) ; port ETH_RGMII.PHY_RESETn
PRI_UART_RxD: IC37.AL8(IO_L24N_T3U_N11_64) ; port PRI_UART.RxD
PRI_UART_TxD: IC37.AK8(IO_L24P_T3U_N10_64) ; port PRI_UART.TxD
QSPI1_CS_B: IC37.G26(IO_L2N_T0L_N3_FWE_FCS2_B_65) ; port CFG_QSPI.QSPI1_CS_B
QSPI1_IO0: IC37.M20(IO_L22P_T3U_N6_DBC_AD0P_D04_65) ; port CFG_QSPI.QSPI1_IO0
QSPI1_IO1: IC37.L20(IO_L22N_T3U_N7_DBC_AD0N_D05_65) ; port CFG_QSPI.QSPI1_IO1
QSPI1_IO2: IC37.R21(IO_L21P_T3L_N4_AD8P_D06_65) ; port CFG_QSPI.QSPI1_IO2
QSPI1_IO3: IC37.R22(IO_L21N_T3L_N5_AD8N_D07_65) ; port CFG_QSPI.QSPI1_IO3
RE_DE_RX_P17: IC37.AH8(IO_L18N_T2U_N11_AD2N_64) ; port MLVDS_FPGA.RE_DE_RX_P17
RE_DE_RX_P18: IC37.AD9(IO_L17P_T2U_N8_AD10P_64) ; port MLVDS_FPGA.RE_DE_RX_P18
RE_DE_RX_P19: IC37.AD8(IO_L17N_T2U_N9_AD10N_64) ; port MLVDS_FPGA.RE_DE_RX_P19
RE_DE_RX_P20: IC37.AD10(IO_L16P_T2U_N6_QBC_AD3P_64) ; port MLVDS_FPGA.RE_DE_RX_P20
RE_DE_TX_P17: IC37.AP9(IO_L20N_T3L_N3_AD1N_64) ; port MLVDS_FPGA.RE_DE_TX_P17
RE_DE_TX_P18: IC37.AL10(IO_L19P_T3L_N0_DBC_AD9P_64) ; port MLVDS_FPGA.RE_DE_TX_P18
RE_DE_TX_P19: IC37.AM10(IO_L19N_T3L_N1_DBC_AD9N_64) ; port MLVDS_FPGA.RE_DE_TX_P19
RE_DE_TX_P20: IC37.AH9(IO_L18P_T2U_N10_AD2P_64) ; port MLVDS_FPGA.RE_DE_TX_P20
RGMII_MDC: IC37.T27(IO_L15P_T2L_N4_AD11P_A02_D18_65) ; port ETH_RGMII.RGMII_MDC
RGMII_MDIO: IC37.R27(IO_L15N_T2L_N5_AD11N_A03_D19_65) ; port ETH_RGMII.RGMII_MDIO
RGMII_RX_CLK: IC37.P24(IO_L14P_T2L_N2_GC_A04_D20_65) ; port ETH_RGMII.RGMII_RX_CLK
RGMII_RX_CTL: IC37.T24(IO_L16P_T2U_N6_QBC_AD3P_A00_D16_65) ; port ETH_RGMII.RGMII_RX_CTL
RGMII_RXD0: IC37.R23(IO_L18P_T2U_N10_AD2P_D12_65) ; port ETH_RGMII.RGMII_RXD0
RGMII_RXD1: IC37.P23(IO_L18N_T2U_N11_AD2N_D13_65) ; port ETH_RGMII.RGMII_RXD1
RGMII_RXD2: IC37.R25(IO_L17P_T2U_N8_AD10P_D14_65) ; port ETH_RGMII.RGMII_RXD2
RGMII_RXD3: IC37.R26(IO_L17N_T2U_N9_AD10N_D15_65) ; port ETH_RGMII.RGMII_RXD3
RGMII_TX_CLK: IC37.M22(IO_L19N_T3L_N1_DBC_AD9N_D11_65) ; port ETH_RGMII.RGMII_TX_CLK
RGMII_TX_CTL: IC37.N22(IO_L19P_T3L_N0_DBC_AD9P_D10_65) ; port ETH_RGMII.RGMII_TX_CTL
RGMII_TXD0: IC37.K20(IO_L24P_T3U_N10_EMCCLK_65) ; port ETH_RGMII.RGMII_TXD0
RGMII_TXD1: IC37.K22(IO_T3U_N12_PERSTN0_65) ; port ETH_RGMII.RGMII_TXD1
RGMII_TXD2: IC37.P20(IO_L20P_T3L_N2_AD1P_D08_65) ; port ETH_RGMII.RGMII_TXD2
RGMII_TXD3: IC37.P21(IO_L20N_T3L_N3_AD1N_D09_65) ; port ETH_RGMII.RGMII_TXD3
RTM_FPGA_CCLK: R308.2 ; port RTM_FPGA_CFG.RTM_FPGA_CCLK
RTM_FPGA_CCLK_R: IC37.J25(IO_L4N_T0U_N7_DBC_AD7N_A25_65) R308.1
RTM_FPGA_DIN: R309.2 ; port RTM_FPGA_CFG.RTM_FPGA_DIN
RTM_FPGA_DIN_R: IC37.K26(IO_L3P_T0L_N4_AD15P_A26_65) R309.1
RTM_FPGA_DONE: R310.2 ; port RTM_FPGA_CFG.RTM_FPGA_DONE
RTM_FPGA_DONE_R: IC37.K27(IO_L3N_T0L_N5_AD15N_A27_65) R310.1
RTM_FPGA_INIT_B: R311.2 ; port RTM_FPGA_CFG.RTM_FPGA_INIT_B
RTM_FPGA_INIT_B_R: IC37.G25(IO_L2P_T0L_N2_FOE_B_65) R311.1
RTM_FPGA_PROGRAM_B: R312.2 ; port RTM_FPGA_CFG.RTM_FPGA_PROGRAM_B
RTM_FPGA_PROGRAM_B_R: IC37.J23(IO_L6P_T0U_N10_AD6P_A20_65) R312.1
RTM_UART_Rx: IC37.H27(IO_L1P_T0L_N0_DBC_RS0_65) ; port RTM_UART.RxD
RTM_UART_Tx: IC37.G27(IO_L1N_T0L_N1_DBC_RS1_65) ; port RTM_UART.TxD
SFP1_LED1: IC37.AG9(IO_L14N_T2L_N3_GC_64) ; port SFP0.SFP_LED1
SFP1_LED2: IC37.AJ10(IO_T2U_N12_64) ; port SFP0.SFP_LED2
SFP1_LOS: IC37.AM11(IO_L3P_T0L_N4_AD15P_64) ; port SFP0.SFP_LOS
SFP1_MOD_DEF0: IC37.AN11(IO_L3N_T0L_N5_AD15N_64) ; port SFP0.SFP_MOD_DEF0
SFP1_MOD_DEF1: IC37.AN13(IO_L2P_T0L_N2_64) ; port SFP0.SFP_MOD_DEF1
SFP1_MOD_DEF2: IC37.AP13(IO_L2N_T0L_N3_64) ; port SFP0.SFP_MOD_DEF2
SFP1_RATE_SELECT: IC37.AK11(IO_T0U_N12_64) ; port SFP0.SFP_RATE_SELECT
SFP1_TX_DISABLE: IC37.AP11(IO_L1P_T0L_N0_DBC_64) ; port SFP0.SFP_TX_DISABLE
SFP1_TX_FAULT: IC37.AP10(IO_L1N_T0L_N1_DBC_64) ; port SFP0.SFP_TX_FAULT
SFP2_LED1: IC37.AJ13(IO_L8N_T1L_N3_AD5N_64) ; port SFP1.SFP_LED1
SFP2_LED2: IC37.AE13(IO_L7P_T1L_N0_QBC_AD13P_64) ; port SFP1.SFP_LED2
SFP2_LOS: IC37.AF13(IO_L7N_T1L_N1_QBC_AD13N_64) ; port SFP1.SFP_LOS
SFP2_MOD_DEF0: IC37.AK13(IO_L6P_T0U_N10_AD6P_64) ; port SFP1.SFP_MOD_DEF0
SFP2_MOD_DEF1: IC37.AL13(IO_L6N_T0U_N11_AD6N_64) ; port SFP1.SFP_MOD_DEF1
SFP2_MOD_DEF2: IC37.AK12(IO_L5P_T0U_N8_AD14P_64) ; port SFP1.SFP_MOD_DEF2
SFP2_RATE_SELECT: IC37.AL12(IO_L5N_T0U_N9_AD14N_64) ; port SFP1.SFP_RATE_SELECT
SFP2_TX_DISABLE: IC37.AM12(IO_L4P_T0U_N6_DBC_AD7P_64) ; port SFP1.SFP_TX_DISABLE
SFP2_TX_FAULT: IC37.AN12(IO_L4N_T0U_N7_DBC_AD7N_64) ; port SFP1.SFP_TX_FAULT
SI5324_INT_ALM: IC37.L22(IO_L10P_T1U_N6_QBC_AD4P_A12_D28_65) ; port WR_I2C_CTRL.SI5324_INT_ALM
SI5324_RST: IC37.L24(IO_L8N_T1L_N3_AD5N_A17_65) ; port WR_I2C_CTRL.SI5324_RST
SMA_IO0: IC37.P26(IO_L13P_T2L_N0_GC_QBC_A06_D22_65) ; port TTL_IO.SMA_IO0
SMA_IO0_DIR: IC37.K25(IO_L9N_T1L_N5_AD12N_A15_D31_65) ; port TTL_IO.SMA_IO0_DIR
SMA_IO1: IC37.N24(IO_L12P_T1U_N10_GC_A08_D24_65) ; port TTL_IO.SMA_IO1
SMA_IO1_DIR: IC37.L23(IO_L8P_T1L_N2_AD5P_A16_65) ; port TTL_IO.SMA_IO1_DIR
NetLD11_2: LD11.2(A) R483.1
NetLD21_2: LD21.2(A) R485.2
NetOSC3_3: OSC3.3(OUT) R307.2

Not connected (* = marked no-connect by the designer): IC37 AF8(IO_L15N_T2L_N5_AD11N_64)

### Layout directives
net class RGMII: MDIO_INTn, PHY_RESETn, QSPI1_IO0, QSPI1_IO1, QSPI1_IO2, QSPI1_IO3, RGMII_MDC, RGMII_MDIO, RGMII_RX_CLK, RGMII_RX_CTL, RGMII_RXD0, RGMII_RXD1, RGMII_RXD2, RGMII_RXD3, RGMII_TX_CLK, RGMII_TX_CTL, RGMII_TXD0, RGMII_TXD1, RGMII_TXD2, RGMII_TXD3

### Notes on the sheet
- We don't need series termination resistors for RGMII - The PHY was moved closed to FPGA and traces are only 2..3cm long.
- Bank 64 HR
- Bank 65 HR
- CPU<-> FPGA communication
- Project/Equipment
- Document
- Designer
- Drawn by
- Check.by
- Copyright WUT ISE 2018.
  This documentation describes Open Hardware and is licensed under the CERN OHL v.1.1. You may redistribute and modify this documentation under the terms of the CERN OHL v.1.1. (http://ohwr.org/CERNOHL). This documentation is distributed WITHOUT ANY EXPRESS OR IMPLIED WARRANTY, INCLUDING OF MERCHANTABILITY, SATISFACTORY QUALITY AND FITNESS FOR A PARTICULAR PURPOSE. Please see the CERN OHL v.1.1 for applicable conditions.
- Contact
- File
- Last Mod.
- Print Date
- Sheet
- Size
- A3
- of
- Rev
- (in symbol R0402_49R9_1%_0.0625W_100PPM) 1%
- (in symbol R0402_330R_1%_0.0625W_100PPM) 1%
- (in symbol XCKU040-1FFVA1156C, part F) BANK 64
- (in symbol XCKU040-1FFVA1156C, part G) BANK 65

### Library data of the parts
C258 = CC0201_100NF_6.3V_10%_X5R: as C247 on sheet FPGA_Banks_47_48_HP_FMC; Manufacturer Part Number: CC0201_100NF_6.3V_10%_X5R; Part Number: CC0201_100NF_6.3V_10%_X5R; Value: 100nF; Component Kind: Standard; Component Type: Standard; Pin Count: 2; Status: Not Recommended; Case: 0201; Mounted: Yes; Socket: No; SMD: Yes; Sense: No; Manufacturer1 Example: AVX; Manufacturer1 ComponentHeight: 0.33mm; HelpURL: \\cern.ch\dfs\Applications\Altium\Datasheets\CC0201_X5R_AVX.pdf; Author: CERN DEM JLC; CreateDate: 03.12.2007; LatestRevisionDate: 03.12.2007
IC37 = XCKU040-1FFVA1156C: as IC37 on sheet FPGA_Banks_47_48_HP_FMC; Manufacturer Part Number: XCKU040-1FFVA1156C; PackageDescription: BGA, 1.00mm Pitch, Square; 1156 Pin, 34 Columns X 34 Rows, Body 35.00mm X 35.00mm X 3.50mm H, IPC Medium Density; Part Number: XCKU040-1FFVA1156C; Component Kind: Standard; Component Type: Standard; Device: XCKU040-1FFVA1156C; Pin Count: 1156; Case: BGA1156; Mounted: Yes; Socket: No; SMD: Yes; Sense: No; ComponentHeight: 3.5mm; HelpURL: \\cern.ch\dfs\Applications\Altium\Datasheets\XCKU040-1FFVA1156C.pdf; ComponentLink1URL: \\cern.ch\dfs\Applications\Altium\Datasheets\XCKU040-1FFVA1156C_Package-Pinout.pdf; ComponentLink1Description: Package/Pinout; Author: CERN DEM CA; CreateDate: 16.08.2016; LatestRevisionDate: 16.08.2016
J18 = SAMTEC_MTLW-106-07-L-D-250: Connector 12 Male; Manufacturer: SAMTEC; Part Description: 12 Contacts, Pitch 2.54mm, Dual Row Through Mount Straight Header (Post Lead = 6.35mm, Tail Lead 3.05mm, Insulator 1.52mm); PressFit: No; Part Number: SAMTEC_MTLW-106-07-L-D-250; Component Kind: Standard; Component Type: Standard; Pin Count: 12; Family: Header 12; Mounted: Yes; Socket: No; Sense: No; SMD: No; Status: None; ComponentHeight: 7.87mm; HelpURL: \\cern.ch\dfs\Applications\Altium\Datasheets\SAMTEC_MTLW-106-07-L-D-250.pdf; Author: CERN DEM JLC; CreateDate: 25.11.2013; LatestRevisionDate: 25.11.2013
LD11 = LED_AVAGO_HSME-C120: LED Green 1C 2A; Manufacturer: AVAGO TECHNOLOGIES; Part Description: High Performance Right Angle Chip Green LED; PressFit: No; Bonding: No; Manufacturer Part Number: HSME-C120; PackageDescription: Green Chip LED, 2-Leads, Body 1.7x1.1mm, Side Emitting Package; Part Number: LED_AVAGO_HSME-C120; Component Kind: Standard; Component Type: Standard; Color: Green; Pin Count: 2; Mounted: Yes; Socket: No; SMD: Yes; Sense: No; ComponentHeight: 0.7mm; HelpURL: \\cern.ch\dfs\Applications\Altium\Datasheets\LED_AVAGO_HSME-C120.pdf; ComponentLink1URL: \\cern.ch\dfs\Applications\Altium\Datasheets\LED_AVAGO_HSME-C110_DESIGN-GUIDE.pdf; ComponentLink1Description: Design Guide; Author: CERN DEM JMW; CreateDate: 22.07.2009; LatestRevisionDate: 20.06.2012
LD21 = LED_KINGBRIGHT_KPH-1608CGCK: LED Green 1C 2A; Part Description: SMD Green LED, Case 1.6mmX0.8mm(0603), 0.65mm Thickness; PressFit: No; Bonding: No; Part Number: LED_KINGBRIGHT_KPH-1608CGCK; Component Kind: Standard; Component Type: Standard; Color: Green; PackageDescription: SMT Green LED, Case 0603, Body L 1.6 x W 0.8mm H 0.65mm; Manufacturer: KINGBRIGHT; Manufacturer Part Number: KPH-1608CGCK; Pin Count: 2; Mounted: Yes; Socket: No; SMD: Yes; Sense: No; ComponentHeight: 0.65mm; HelpURL: \\cern.ch\dfs\Applications\Altium\Datasheets\LED_KINGBRIGHT_KPH-1608CGCK.pdf; Author: CERN DEM JLC; CreateDate: 03.07.2017; LatestRevisionDate: 03.07.2017
OSC3 = OSC_50MHZ_CTS_636L3I050M00000: Oscillator 4 pins 1=OE 2=GND 3=OUT 4=VCC; Manufacturer: CTS ELECTRONIC COMPONENTS; Part Description: 3.3V, ±50ppm, 30pF, -40..85°C, HCMOS/TTL Clock Oscillator, 636 Series; PressFit: No; Bonding: No; Manufacturer Part Number: 636L3I050M00000; PackageDescription: Oscillator, Side Concave; 2.54mm Pitch; 4 pin, 3.20mm L X 5.00mm W X 1.30mm H, IPC Medium Density; Part Number: OSC_50MHZ_CTS_636L3I050M00000; Value: 50MHz; Component Kind: Standard; Component Type: Standard; Pin Count: 4; Mounted: Yes; Socket: No; SMD: Yes; Sense: No; ComponentHeight: 1.3mm; HelpURL: \\cern.ch\dfs\Applications\Altium\Datasheets\OSC_CTS_636.pdf; Author: CERN DEM JMW; CreateDate: 22.09.2015; LatestRevisionDate: 22.09.2015
R307 = R0402_49R9_1%_0.0625W_100PPM: as R549 on sheet FPGA_Banks_47_48_HP_FMC; Manufacturer Part Number: R0402_49R9_1%_0.0625W_100PPM; Part Number: R0402_49R9_1%_0.0625W_100PPM; Tolerance: ±1%; Value: 49R9; Component Kind: Standard; Component Type: Standard; Pin Count: 2; Status: Not Recommended; Power: 0.0625W; Case: 0402; Mounted: Yes; Sense: No; Socket: No; SMD: Yes; Manufacturer1 Example: YAGEO PHYCOMP; Manufacturer1 ComponentHeight: 0.4mm; HelpURL: \\cern.ch\dfs\Applications\Altium\Datasheets\R0402_Phycomp_RC0402.pdf; Author: CERN DEM JLC; CreateDate: 24.10.2012; LatestRevisionDate: 24.10.2012
R308-R312 = R0402_0R_JUMPER: Resistor; Manufacturer: GENERIC; Part Description: 1A (0.05R Max DC Resistance) Zero Ohm Jumper; Manufacturer1 Part Number: 232270591001L; PressFit: No; Manufacturer Part Number: R0402_0R_JUMPER; Part Number: R0402_0R_JUMPER; Value: 0; Component Kind: Standard; Component Type: Standard; Pin Count: 2; Status: Not Recommended; Case: 0402; Mounted: Yes; Sense: No; Socket: No; SMD: Yes; Manufacturer1 Example: YAGEO PHYCOMP; Manufacturer1 ComponentHeight: 0.4mm; HelpURL: \\cern.ch\dfs\Applications\Altium\Datasheets\R0402_Phycomp_RC0402.pdf; Author: CERN DEM JLC; CreateDate: 03.12.2007; LatestRevisionDate: 17.10.2012
R483 R485 = R0402_330R_1%_0.0625W_100PPM: Resistor - 1%; Manufacturer: GENERIC; Part Description: General Purpose Thick Film Chip Resistor; Manufacturer1 Part Number: 232270673301L; TC: ±100ppm/°C; PressFit: No; Manufacturer Part Number: R0402_330R_1%_0.0625W_100PPM; Part Number: R0402_330R_1%_0.0625W_100PPM; Tolerance: ±1%; Value: 330; Component Kind: Standard; Component Type: Standard; Pin Count: 2; Status: Not Recommended; Power: 0.0625W; Case: 0402; Mounted: Yes; Sense: No; Socket: No; SMD: Yes; Manufacturer1 Example: YAGEO PHYCOMP; Manufacturer1 ComponentHeight: 0.4mm; HelpURL: \\cern.ch\dfs\Applications\Altium\Datasheets\R0402_Phycomp_RC0402.pdf; Author: CERN DEM JLC; CreateDate: 03.12.2007; LatestRevisionDate: 17.10.2012

## Sheet FPGA_Banks_67_68_DDR32.SchDoc: Sayma AMC
size 420 x 297 mm; $$Internal___BlkDate: 0:12:25_2-9-18; $$Internal_NAME_PLACEHOLDER: a3sheet; $$Internal_Resolution: 00001mm; $$NotCommonProperty_@NAME: FPGA_XCKU040FFVA1156; $$NotCommonProperty_@PRINTORDER: 19; $$NotCommonProperty_@SHEET: FPGA Banks 67 68 DDR32; $$NotCommonProperty_@SHEETTOTAL: 30; CmpIndex: 991; Drawing Author: G.Kasprowicz; Drawing Number: Sayma AMC; Drawing Project: AMC FMC Carrier Board; Drawing Revision: 2.0; SymIndex: 2141; CheckedBy: P.Kulik,T.Przywozki,W.Ruclo; Author: G.Kasprowicz; CompanyName: WUT ISE; DrawnBy: G.Kasprowicz; Organization: WUT ISE; Address1: PW ISE; Address2: Nowowiejska 15/19 00-665 Warsaw; Address3: gkasprow@gmail.com; DocumentNumber: 27; Revision: 2; SheetNumber: 27; SheetTotal: 32; ModifiedBy: -; CheckedDate: -; Title2: FPGA banks 67 & 68; DivGrp: WUT ISE; Designer: G.Kasprowicz; ModifiedDate: -; ProjectName: Sensor Box
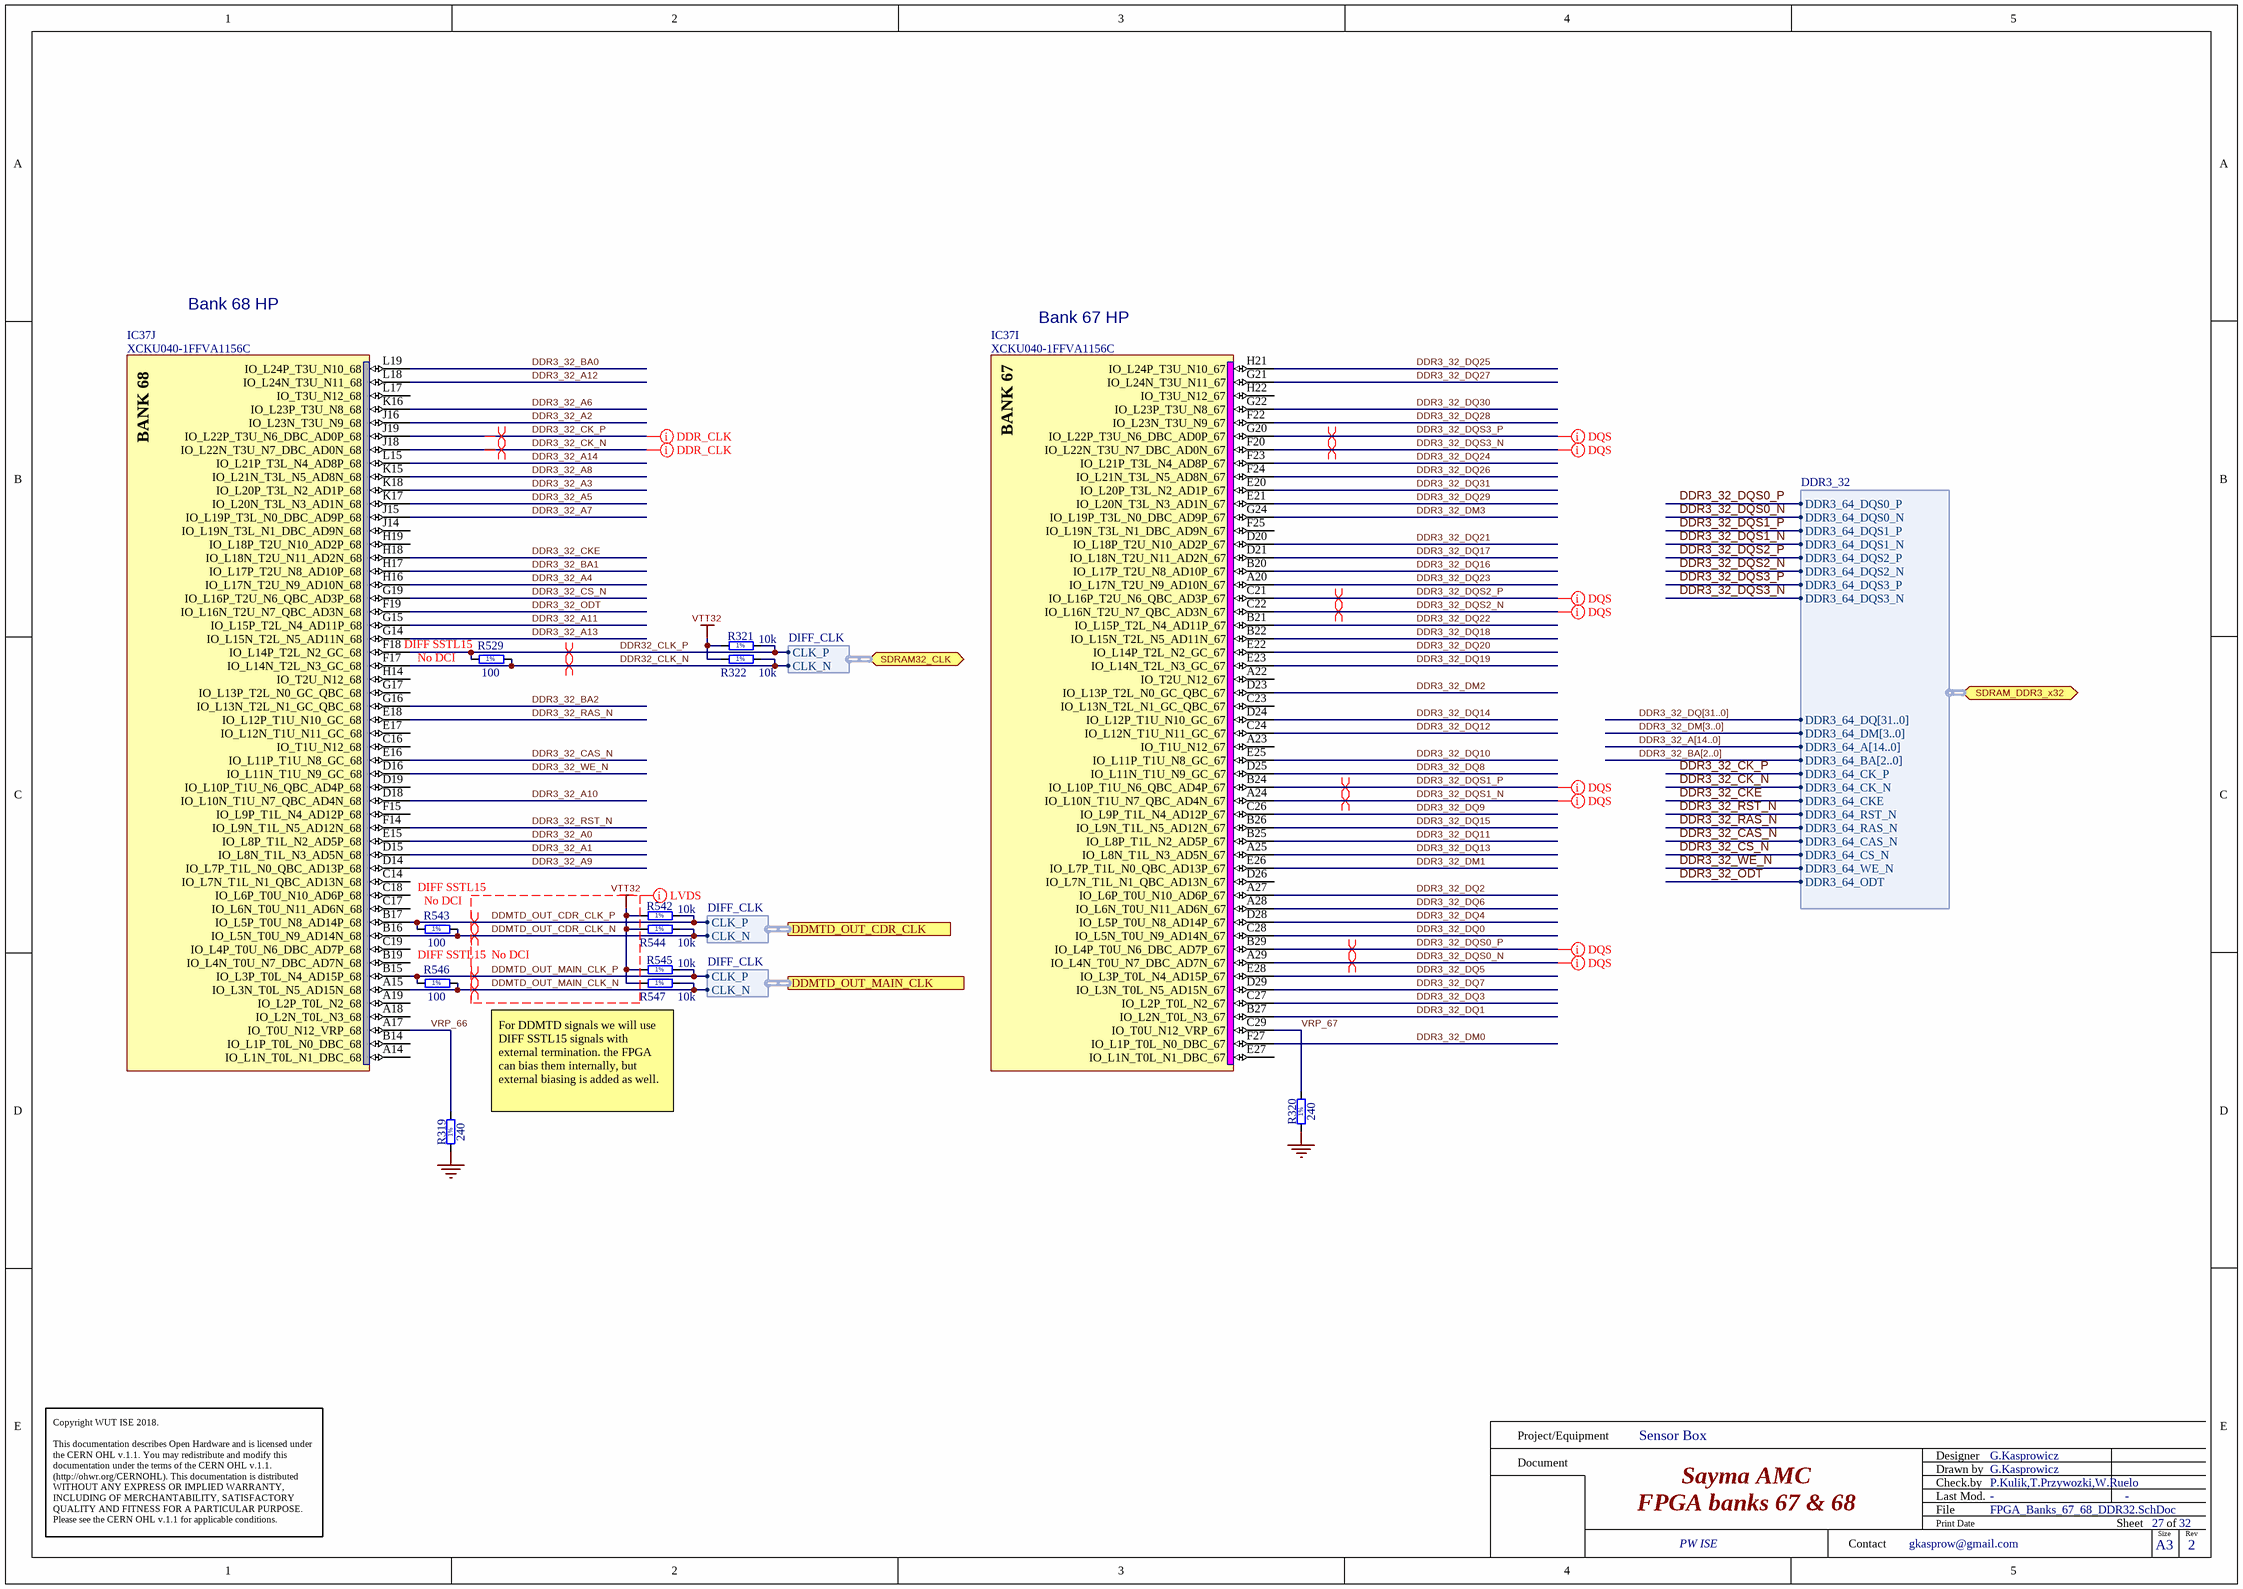
[diagram p24: FPGA_Banks_67_68_DDR32.SchDoc]

### Parts
IC37  XCKU040-1FFVA1156C  [BGA1156C100P34X34_3500X3500X350]  (parts I,J of 22)
R319  240  [RESC1005X40N]
R320  240  [RESC1005X40N]
R321  10k  [RESC1005X40N]
R322  10k  [RESC1005X40N]
R529  100  [RESC0603X28N]
R542  10k  [RESC1005X40N]
R543  100  [RESC0603X28N]
R544  10k  [RESC1005X40N]
R545  10k  [RESC1005X40N]
R546  100  [RESC0603X28N]
R547  10k  [RESC1005X40N]

### Ports
DDMTD_OUT_CDR_CLK (harness DIFF_CLK), DDMTD_OUT_MAIN_CLK (harness DIFF_CLK), SDRAM32_CLK (bidir, harness DIFF_CLK), SDRAM_DDR3_x32 (bidir, harness DDR3_32)

### Harnesses
DDR3_32: DDR3_64_DQS0_P, DDR3_64_DQS0_N, DDR3_64_DQS1_P, DDR3_64_DQS1_N, DDR3_64_DQS2_P, DDR3_64_DQS2_N, DDR3_64_DQS3_P, DDR3_64_DQS3_N, DDR3_64_DQ[31..0], DDR3_64_DM[3..0], DDR3_64_A[14..0], DDR3_64_BA[2..0], DDR3_64_CK_P, DDR3_64_CK_N, DDR3_64_CKE, DDR3_64_RST_N, DDR3_64_RAS_N, DDR3_64_CAS_N, DDR3_64_CS_N, DDR3_64_WE_N, DDR3_64_ODT
DIFF_CLK: CLK_N, CLK_P

### Nets
GND: R319.1 R320.1
VTT32: R321.1 R322.1 R542.1 R544.1 R545.1 R547.1
DDMTD_OUT_CDR_CLK_N: IC37.B16(IO_L5N_T0U_N9_AD14N_68) R543.2 R544.2 ; port DDMTD_OUT_CDR_CLK.CLK_N
DDMTD_OUT_CDR_CLK_P: IC37.B17(IO_L5P_T0U_N8_AD14P_68) R542.2 R543.1 ; port DDMTD_OUT_CDR_CLK.CLK_P
DDMTD_OUT_MAIN_CLK_N: IC37.A15(IO_L3N_T0L_N5_AD15N_68) R546.2 R547.2 ; port DDMTD_OUT_MAIN_CLK.CLK_N
DDMTD_OUT_MAIN_CLK_P: IC37.B15(IO_L3P_T0L_N4_AD15P_68) R545.2 R546.1 ; port DDMTD_OUT_MAIN_CLK.CLK_P
DDR3_32_A0: IC37.E15(IO_L8P_T1L_N2_AD5P_68)
DDR3_32_A1: IC37.D15(IO_L8N_T1L_N3_AD5N_68)
DDR3_32_A2: IC37.J16(IO_L23N_T3U_N9_68)
DDR3_32_A3: IC37.K18(IO_L20P_T3L_N2_AD1P_68)
DDR3_32_A4: IC37.H16(IO_L17N_T2U_N9_AD10N_68)
DDR3_32_A5: IC37.K17(IO_L20N_T3L_N3_AD1N_68)
DDR3_32_A6: IC37.K16(IO_L23P_T3U_N8_68)
DDR3_32_A7: IC37.J15(IO_L19P_T3L_N0_DBC_AD9P_68)
DDR3_32_A8: IC37.K15(IO_L21N_T3L_N5_AD8N_68)
DDR3_32_A9: IC37.D14(IO_L7P_T1L_N0_QBC_AD13P_68)
DDR3_32_A10: IC37.D18(IO_L10N_T1U_N7_QBC_AD4N_68)
DDR3_32_A11: IC37.G15(IO_L15P_T2L_N4_AD11P_68)
DDR3_32_A12: IC37.L18(IO_L24N_T3U_N11_68)
DDR3_32_A13: IC37.G14(IO_L15N_T2L_N5_AD11N_68)
DDR3_32_A14: IC37.L15(IO_L21P_T3L_N4_AD8P_68)
DDR3_32_BA0: IC37.L19(IO_L24P_T3U_N10_68)
DDR3_32_BA1: IC37.H17(IO_L17P_T2U_N8_AD10P_68)
DDR3_32_BA2: IC37.G16(IO_L13N_T2L_N1_GC_QBC_68)
DDR3_32_CAS_N: IC37.E16(IO_L11P_T1U_N8_GC_68) ; port SDRAM_DDR3_x32.DDR3_64_CAS_N
DDR3_32_CK_N: IC37.J18(IO_L22N_T3U_N7_DBC_AD0N_68) ; port SDRAM_DDR3_x32.DDR3_64_CK_N
DDR3_32_CK_P: IC37.J19(IO_L22P_T3U_N6_DBC_AD0P_68) ; port SDRAM_DDR3_x32.DDR3_64_CK_P
DDR3_32_CKE: IC37.H18(IO_L18N_T2U_N11_AD2N_68) ; port SDRAM_DDR3_x32.DDR3_64_CKE
DDR3_32_CS_N: IC37.G19(IO_L16P_T2U_N6_QBC_AD3P_68) ; port SDRAM_DDR3_x32.DDR3_64_CS_N
DDR3_32_DM0: IC37.F27(IO_L1P_T0L_N0_DBC_67)
DDR3_32_DM1: IC37.E26(IO_L7P_T1L_N0_QBC_AD13P_67)
DDR3_32_DM2: IC37.D23(IO_L13P_T2L_N0_GC_QBC_67)
DDR3_32_DM3: IC37.G24(IO_L19P_T3L_N0_DBC_AD9P_67)
DDR3_32_DQ0: IC37.C28(IO_L5N_T0U_N9_AD14N_67)
DDR3_32_DQ1: IC37.B27(IO_L2N_T0L_N3_67)
DDR3_32_DQ2: IC37.A27(IO_L6P_T0U_N10_AD6P_67)
DDR3_32_DQ3: IC37.C27(IO_L2P_T0L_N2_67)
DDR3_32_DQ4: IC37.D28(IO_L5P_T0U_N8_AD14P_67)
DDR3_32_DQ5: IC37.E28(IO_L3P_T0L_N4_AD15P_67)
DDR3_32_DQ6: IC37.A28(IO_L6N_T0U_N11_AD6N_67)
DDR3_32_DQ7: IC37.D29(IO_L3N_T0L_N5_AD15N_67)
DDR3_32_DQ8: IC37.D25(IO_L11N_T1U_N9_GC_67)
DDR3_32_DQ9: IC37.C26(IO_L9P_T1L_N4_AD12P_67)
DDR3_32_DQ10: IC37.E25(IO_L11P_T1U_N8_GC_67)
DDR3_32_DQ11: IC37.B25(IO_L8P_T1L_N2_AD5P_67)
DDR3_32_DQ12: IC37.C24(IO_L12N_T1U_N11_GC_67)
DDR3_32_DQ13: IC37.A25(IO_L8N_T1L_N3_AD5N_67)
DDR3_32_DQ14: IC37.D24(IO_L12P_T1U_N10_GC_67)
DDR3_32_DQ15: IC37.B26(IO_L9N_T1L_N5_AD12N_67)
DDR3_32_DQ16: IC37.B20(IO_L17P_T2U_N8_AD10P_67)
DDR3_32_DQ17: IC37.D21(IO_L18N_T2U_N11_AD2N_67)
DDR3_32_DQ18: IC37.B22(IO_L15N_T2L_N5_AD11N_67)
DDR3_32_DQ19: IC37.E23(IO_L14N_T2L_N3_GC_67)
DDR3_32_DQ20: IC37.E22(IO_L14P_T2L_N2_GC_67)
DDR3_32_DQ21: IC37.D20(IO_L18P_T2U_N10_AD2P_67)
DDR3_32_DQ22: IC37.B21(IO_L15P_T2L_N4_AD11P_67)
DDR3_32_DQ23: IC37.A20(IO_L17N_T2U_N9_AD10N_67)
DDR3_32_DQ24: IC37.F23(IO_L21P_T3L_N4_AD8P_67)
DDR3_32_DQ25: IC37.H21(IO_L24P_T3U_N10_67)
DDR3_32_DQ26: IC37.F24(IO_L21N_T3L_N5_AD8N_67)
DDR3_32_DQ27: IC37.G21(IO_L24N_T3U_N11_67)
DDR3_32_DQ28: IC37.F22(IO_L23N_T3U_N9_67)
DDR3_32_DQ29: IC37.E21(IO_L20N_T3L_N3_AD1N_67)
DDR3_32_DQ30: IC37.G22(IO_L23P_T3U_N8_67)
DDR3_32_DQ31: IC37.E20(IO_L20P_T3L_N2_AD1P_67)
DDR3_32_DQS0_N: IC37.A29(IO_L4N_T0U_N7_DBC_AD7N_67) ; port SDRAM_DDR3_x32.DDR3_64_DQS0_N
DDR3_32_DQS0_P: IC37.B29(IO_L4P_T0U_N6_DBC_AD7P_67) ; port SDRAM_DDR3_x32.DDR3_64_DQS0_P
DDR3_32_DQS1_N: IC37.A24(IO_L10N_T1U_N7_QBC_AD4N_67) ; port SDRAM_DDR3_x32.DDR3_64_DQS1_N
DDR3_32_DQS1_P: IC37.B24(IO_L10P_T1U_N6_QBC_AD4P_67) ; port SDRAM_DDR3_x32.DDR3_64_DQS1_P
DDR3_32_DQS2_N: IC37.C22(IO_L16N_T2U_N7_QBC_AD3N_67) ; port SDRAM_DDR3_x32.DDR3_64_DQS2_N
DDR3_32_DQS2_P: IC37.C21(IO_L16P_T2U_N6_QBC_AD3P_67) ; port SDRAM_DDR3_x32.DDR3_64_DQS2_P
DDR3_32_DQS3_N: IC37.F20(IO_L22N_T3U_N7_DBC_AD0N_67) ; port SDRAM_DDR3_x32.DDR3_64_DQS3_N
DDR3_32_DQS3_P: IC37.G20(IO_L22P_T3U_N6_DBC_AD0P_67) ; port SDRAM_DDR3_x32.DDR3_64_DQS3_P
DDR3_32_ODT: IC37.F19(IO_L16N_T2U_N7_QBC_AD3N_68) ; port SDRAM_DDR3_x32.DDR3_64_ODT
DDR3_32_RAS_N: IC37.E18(IO_L12P_T1U_N10_GC_68) ; port SDRAM_DDR3_x32.DDR3_64_RAS_N
DDR3_32_RST_N: IC37.F14(IO_L9N_T1L_N5_AD12N_68) ; port SDRAM_DDR3_x32.DDR3_64_RST_N
DDR3_32_WE_N: IC37.D16(IO_L11N_T1U_N9_GC_68) ; port SDRAM_DDR3_x32.DDR3_64_WE_N
DDR32_CLK_N: IC37.F17(IO_L14N_T2L_N3_GC_68) R322.2 R529.2 ; port SDRAM32_CLK.CLK_N
DDR32_CLK_P: IC37.F18(IO_L14P_T2L_N2_GC_68) R321.2 R529.1 ; port SDRAM32_CLK.CLK_P
VRP_66: IC37.A17(IO_T0U_N12_VRP_68) R319.2
VRP_67: IC37.C29(IO_T0U_N12_VRP_67) R320.2

Not connected (* = marked no-connect by the designer): IC37 A14(IO_L1N_T0L_N1_DBC_68) A18(IO_L2N_T0L_N3_68) A19(IO_L2P_T0L_N2_68) A22(IO_T2U_N12_67) A23(IO_T1U_N12_67) B14(IO_L1P_T0L_N0_DBC_68) B19(IO_L4N_T0U_N7_DBC_AD7N_68) C14(IO_L7N_T1L_N1_QBC_AD13N_68) C16(IO_T1U_N12_68) C17(IO_L6N_T0U_N11_AD6N_68) C18(IO_L6P_T0U_N10_AD6P_68) C19(IO_L4P_T0U_N6_DBC_AD7P_68) C23(IO_L13N_T2L_N1_GC_QBC_67) D19(IO_L10P_T1U_N6_QBC_AD4P_68) D26(IO_L7N_T1L_N1_QBC_AD13N_67) E17(IO_L12N_T1U_N11_GC_68) E27(IO_L1N_T0L_N1_DBC_67) F15(IO_L9P_T1L_N4_AD12P_68) F25(IO_L19N_T3L_N1_DBC_AD9N_67) G17(IO_L13P_T2L_N0_GC_QBC_68) H14(IO_T2U_N12_68) H19(IO_L18P_T2U_N10_AD2P_68) H22(IO_T3U_N12_67) J14(IO_L19N_T3L_N1_DBC_AD9N_68) L17(IO_T3U_N12_68)

### Buses and harness runs
bus DDR3_32_A[14..0]
bus DDR3_32_BA[2..0]
bus DDR3_32_DM[3..0]
bus DDR3_32_DQ[31..0]

### Layout directives
differential pair: DDMTD_OUT_CDR_CLK_N, DDMTD_OUT_CDR_CLK_P, DDMTD_OUT_MAIN_CLK_N, DDMTD_OUT_MAIN_CLK_P, DDR3_32_CK_N, DDR3_32_CK_P, DDR3_32_DQS0_N, DDR3_32_DQS0_P, DDR3_32_DQS1_N, DDR3_32_DQS1_P, DDR3_32_DQS2_N, DDR3_32_DQS2_P, DDR3_32_DQS3_N, DDR3_32_DQS3_P, DDR32_CLK_N, DDR32_CLK_P
net class LVDS: DDMTD_OUT_CDR_CLK_N, DDMTD_OUT_CDR_CLK_P, DDMTD_OUT_MAIN_CLK_N, DDMTD_OUT_MAIN_CLK_P, VTT32
net class DQS: DDR3_32_DQS0_N, DDR3_32_DQS0_P, DDR3_32_DQS1_N, DDR3_32_DQS1_P, DDR3_32_DQS2_N, DDR3_32_DQS2_P, DDR3_32_DQS3_N, DDR3_32_DQS3_P
net class DDR_CLK: DDR3_32_CK_N, DDR3_32_CK_P

### Notes on the sheet
- Bank 68 HP
- Bank 67 HP
- (near R529) DIFF SSTL15
- (near R529) No DCI
- DIFF SSTL15
- (near R543) No DCI
- No DCI
- For DDMTD signals we will use DIFF SSTL15 signals with external termination. the FPGA can bias them internally, but external biasing is added as well.
- Project/Equipment
- Document
- Designer
- Drawn by
- Check.by
- Copyright WUT ISE 2018.
  This documentation describes Open Hardware and is licensed under the CERN OHL v.1.1. You may redistribute and modify this documentation under the terms of the CERN OHL v.1.1. (http://ohwr.org/CERNOHL). This documentation is distributed WITHOUT ANY EXPRESS OR IMPLIED WARRANTY, INCLUDING OF MERCHANTABILITY, SATISFACTORY QUALITY AND FITNESS FOR A PARTICULAR PURPOSE. Please see the CERN OHL v.1.1 for applicable conditions.
- Contact
- File
- Last Mod.
- Print Date
- Sheet
- Size
- A3
- of
- Rev
- (in symbol R0201_100R_1%_0.05W_200PPM) 1%
- (in symbol R0402_10K_1%_0.0625W_100PPM) 1%
- (in symbol R0402_240R_1%_0.0625W_100PPM) 1%
- (in symbol XCKU040-1FFVA1156C, part I) BANK 67
- (in symbol XCKU040-1FFVA1156C, part J) BANK 68

### Library data of the parts
IC37 = XCKU040-1FFVA1156C: as IC37 on sheet FPGA_Banks_47_48_HP_FMC; PackageDescription: BGA, 1.00mm Pitch, Square; 1156 Pin, 34 Columns X 34 Rows, Body 35.00mm X 35.00mm X 3.50mm H, IPC Medium Density; Part Number: XCKU040-1FFVA1156C; Component Kind: Standard; Component Type: Standard; Device: XCKU040-1FFVA1156C; Manufacturer Part Number: XCKU040-1FFVA1156C; Pin Count: 1156; Case: BGA1156; Mounted: Yes; Socket: No; SMD: Yes; Sense: No; ComponentHeight: 3.5mm; HelpURL: \\cern.ch\dfs\Applications\Altium\Datasheets\XCKU040-1FFVA1156C.pdf; ComponentLink1URL: \\cern.ch\dfs\Applications\Altium\Datasheets\XCKU040-1FFVA1156C_Package-Pinout.pdf; ComponentLink1Description: Package/Pinout; Author: CERN DEM CA; CreateDate: 16.08.2016; LatestRevisionDate: 16.08.2016
R319 R320 = R0402_240R_1%_0.0625W_100PPM: as R283 on sheet FPGA_Banks_47_48_HP_FMC; Manufacturer Part Number: R0402_240R_1%_0.0625W_100PPM; Part Number: R0402_240R_1%_0.0625W_100PPM; Tolerance: ±1%; Value: 240; Component Kind: Standard; Component Type: Standard; Pin Count: 2; Status: Not Recommended; Power: 0.0625W; Case: 0402; Mounted: Yes; Sense: No; Socket: No; SMD: Yes; Manufacturer1 Example: YAGEO PHYCOMP; Manufacturer1 ComponentHeight: 0.4mm; HelpURL: \\cern.ch\dfs\Applications\Altium\Datasheets\R0402_Phycomp_RC0402.pdf; Author: CERN DEM JLC; CreateDate: 03.12.2007; LatestRevisionDate: 17.10.2012
R321 R322 R542 R544 R545 R547 = R0402_10K_1%_0.0625W_100PPM: as R548 on sheet FPGA_Banks_47_48_HP_FMC; Manufacturer Part Number: R0402_10K_1%_0.0625W_100PPM; Part Number: R0402_10K_1%_0.0625W_100PPM; Tolerance: ±1%; Value: 10k; Component Kind: Standard; Component Type: Standard; Pin Count: 2; Status: Not Recommended; Power: 0.0625W; Case: 0402; Mounted: Yes; Sense: No; Socket: No; SMD: Yes; Manufacturer1 Example: YAGEO PHYCOMP; Manufacturer1 ComponentHeight: 0.4mm; HelpURL: \\cern.ch\dfs\Applications\Altium\Datasheets\R0402_Phycomp_RC0402.pdf; Author: CERN DEM JLC; CreateDate: 03.12.2007; LatestRevisionDate: 17.10.2012
R529 R543 R546 = R0201_100R_1%_0.05W_200PPM: Resistor - 1%; Manufacturer: GENERIC; Part Description: Thick Film Chip Resistor; Manufacturer1 Part Number: CRCW0201100RFNED; Power: 0.05W; TC: ±200ppm/°C; PressFit: No; Manufacturer Part Number: R0201_100R_1%_0.05W_200PPM; Part Number: R0201_100R_1%_0.05W_200PPM; Tolerance: ±1%; Value: 100; Component Kind: Standard; Component Type: Standard; Pin Count: 2; Status: Not Recommended; Case: 0201; Mounted: Yes; Sense: No; Socket: No; SMD: Yes; Manufacturer1 Example: VISHAY; Manufacturer1 ComponentHeight: 0.27mm; HelpURL: \\cern.ch\dfs\Applications\Altium\Datasheets\R0201_VISHAY_CRCW0201 e3.pdf; Author: CERN DEM JLC; CreateDate: 13.11.2014; LatestRevisionDate: 13.11.2014